# Altium project LimeSDR-QPCIe_1v2.PrjPcb (part 6 of 13)

## Sheet 16_FPGA_pwr_banks.SchDoc: FPGA power banks
size A3; Organization: Lime Microsystems; Address1: Surrey Tech Centre; Address2: Guildford GU2 7YG; Address3: Surrey; Address4: United Kingdom; Revision: v1.2; SheetNumber: 14; SheetTotal: 27
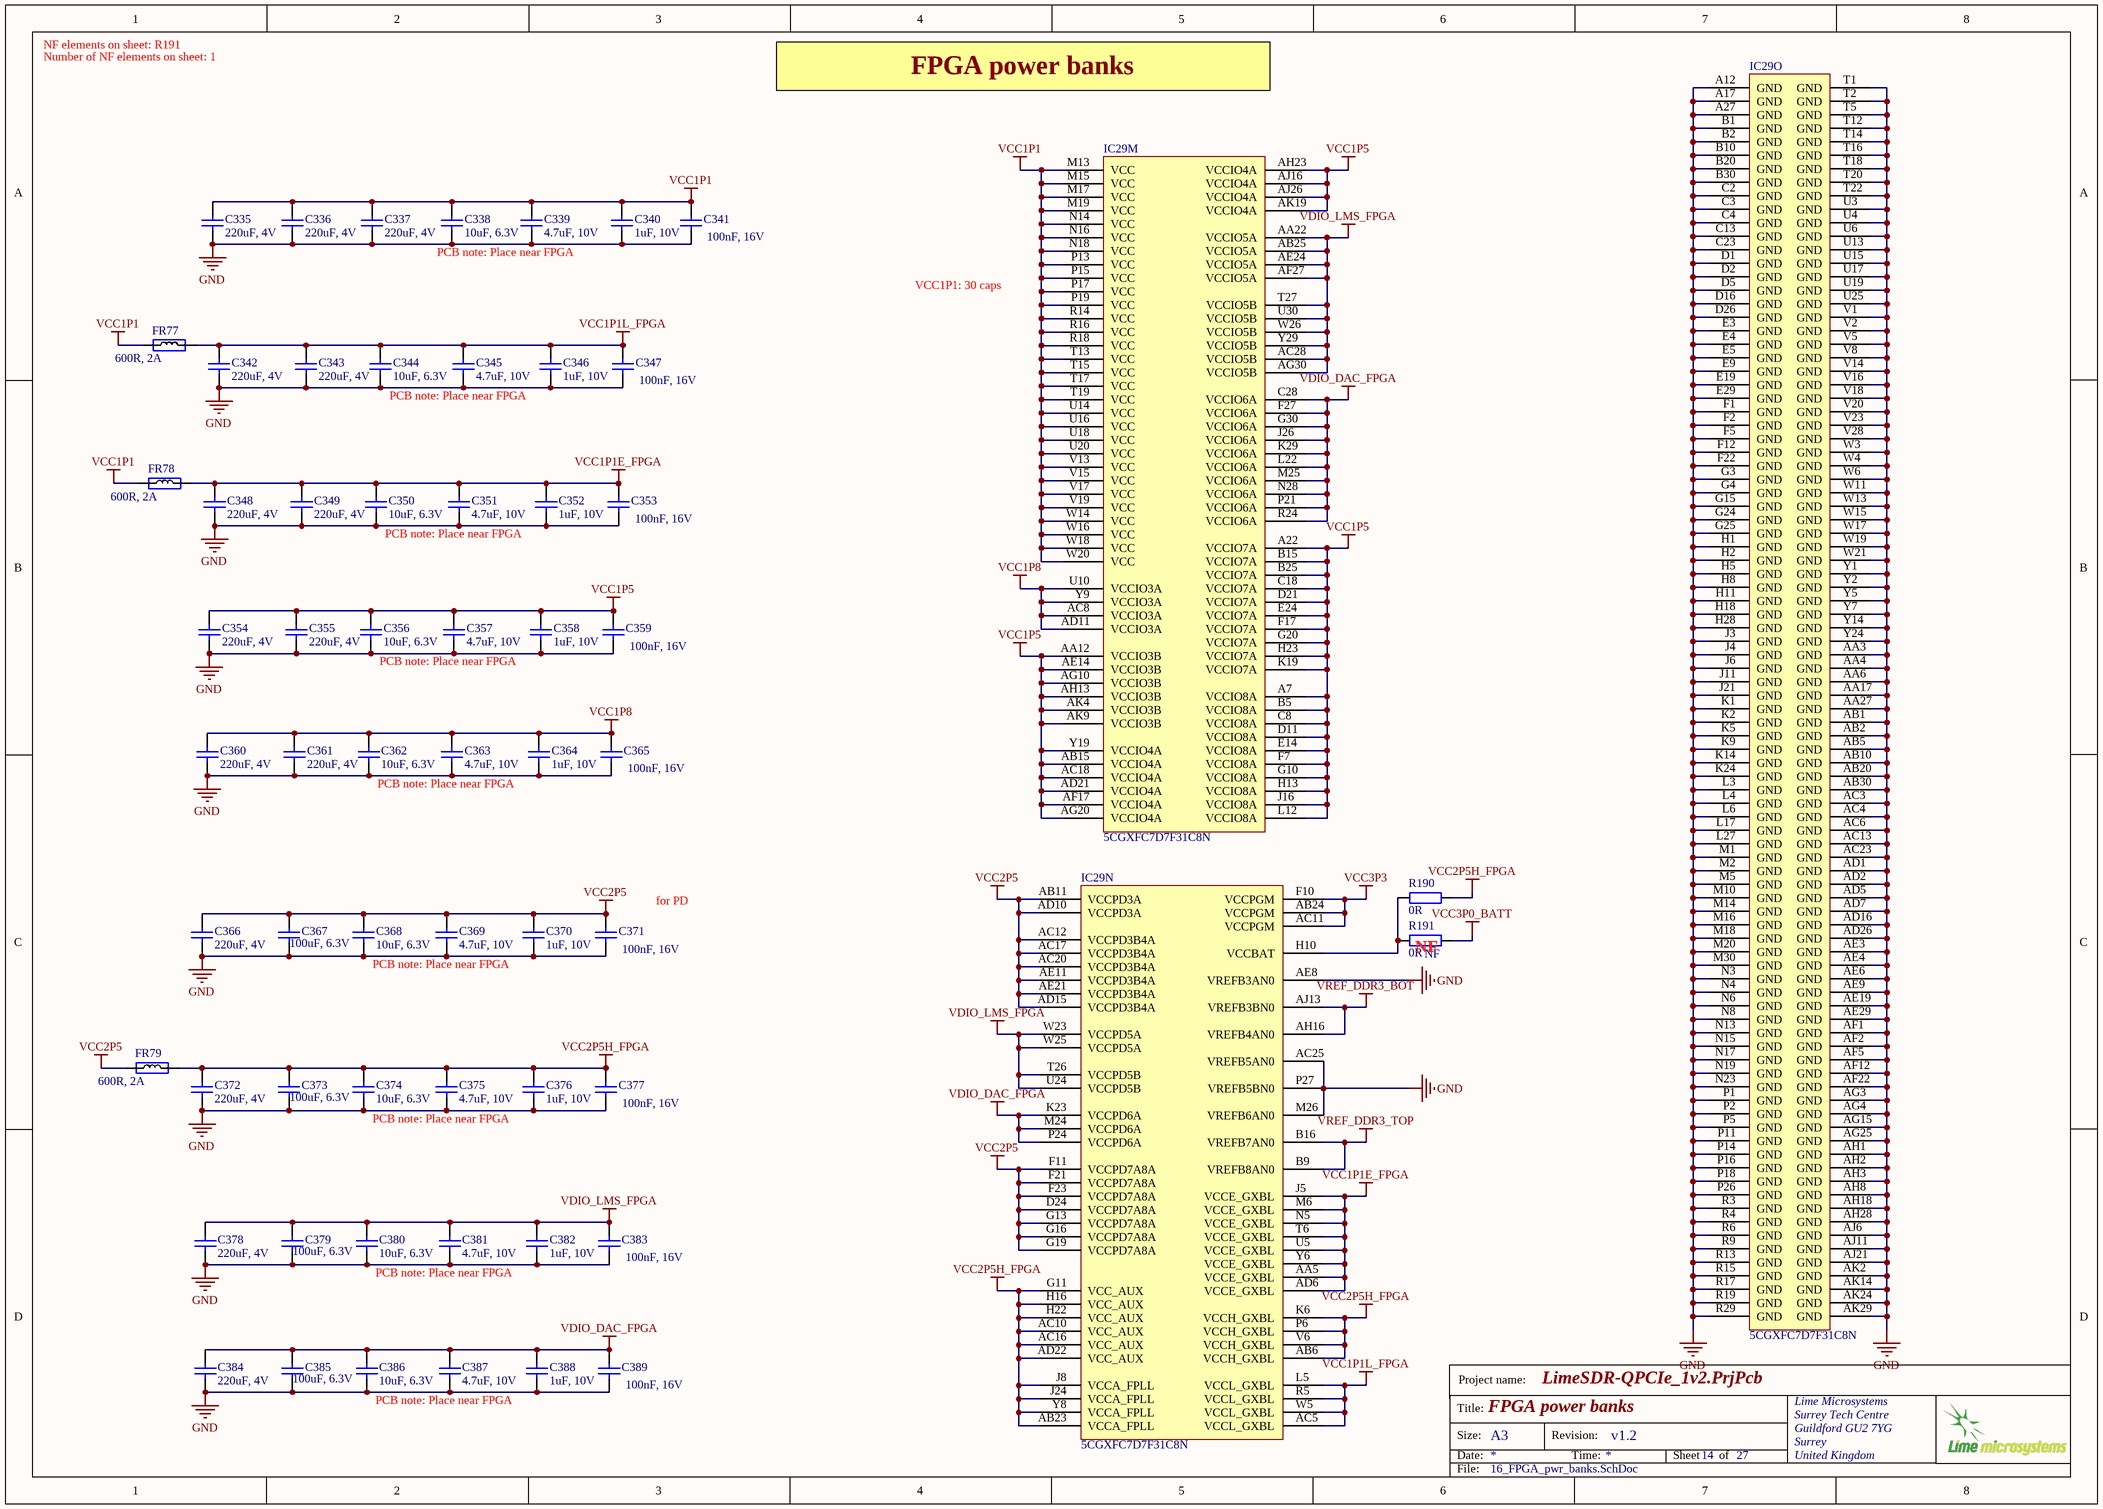
[diagram p15: 16_FPGA_pwr_banks.SchDoc]

### Parts
C335  220uF, 4V  [CAP1206]
C336  220uF, 4V  [CAP1206]
C337  220uF, 4V  [CAP1206]
C338  10uF, 6.3V  [CAP0603]
C339  4.7uF, 10V  [CAP0603]
C340  1uF, 10V  [CAP0402]
C341  100nF, 16V  [CAP0402]
C342  220uF, 4V  [CAP1206]
C343  220uF, 4V  [CAP1206]
C344  10uF, 6.3V  [CAP0603]
C345  4.7uF, 10V  [CAP0603]
C346  1uF, 10V  [CAP0402]
C347  100nF, 16V  [CAP0402]
C348  220uF, 4V  [CAP1206]
C349  220uF, 4V  [CAP1206]
C350  10uF, 6.3V  [CAP0603]
C351  4.7uF, 10V  [CAP0603]
C352  1uF, 10V  [CAP0402]
C353  100nF, 16V  [CAP0402]
C354  220uF, 4V  [CAP1206]
C355  220uF, 4V  [CAP1206]
C356  10uF, 6.3V  [CAP0603]
C357  4.7uF, 10V  [CAP0603]
C358  1uF, 10V  [CAP0402]
C359  100nF, 16V  [CAP0402]
C360  220uF, 4V  [CAP1206]
C361  220uF, 4V  [CAP1206]
C362  10uF, 6.3V  [CAP0603]
C363  4.7uF, 10V  [CAP0603]
C364  1uF, 10V  [CAP0402]
C365  100nF, 16V  [CAP0402]
C366  220uF, 4V  [CAP1206]
C367  100uF, 6.3V  [CAP1206]
C368  10uF, 6.3V  [CAP0603]
C369  4.7uF, 10V  [CAP0603]
C370  1uF, 10V  [CAP0402]
C371  100nF, 16V  [CAP0402]
C372  220uF, 4V  [CAP1206]
C373  100uF, 6.3V  [CAP1206]
C374  10uF, 6.3V  [CAP0603]
C375  4.7uF, 10V  [CAP0603]
C376  1uF, 10V  [CAP0402]
C377  100nF, 16V  [CAP0402]
C378  220uF, 4V  [CAP1206]
C379  100uF, 6.3V  [CAP1206]
C380  10uF, 6.3V  [CAP0603]
C381  4.7uF, 10V  [CAP0603]
C382  1uF, 10V  [CAP0402]
C383  100nF, 16V  [CAP0402]
C384  220uF, 4V  [CAP1206]
C385  100uF, 6.3V  [CAP1206]
C386  10uF, 6.3V  [CAP0603]
C387  4.7uF, 10V  [CAP0603]
C388  1uF, 10V  [CAP0402]
C389  100nF, 16V  [CAP0402]
FR77  600R, 2A  [RES0805]
FR78  600R, 2A  [RES0805]
FR79  600R, 2A  [RES0805]
IC29  5CGXFC7D7F31C8N  [ALTR-FBGA896_A-200]  (parts M,N,O of 16)
R190  0R  [RES0402]
R191  0R  Assembly Info: NF  [RES0402]

### Nets
GND: C335.1 C336.1 C337.1 C338.1 C339.1 C340.2 C341.2 C342.1 C343.1 C344.1 C345.1 C346.1 C347.2 C348.1 C349.1 C350.1 C351.1 C352.1 C353.2 C354.1 C355.1 C356.1 C357.1 C358.1 C359.2 C360.1 C361.1 C362.1 C363.1 C364.1 C365.2 C366.1 C367.1 C368.1 C369.1 C370.1 C371.2 C372.1 C373.1 C374.1 C375.1 C376.1 C377.2 C378.1 C379.1 C380.1 C381.1 C382.1 C383.2 C384.1 C385.1 C386.1 C387.1 C388.1 C389.2 IC29.A12(GND) IC29.A17(GND) IC29.A27(GND) IC29.AA3(GND) IC29.AA4(GND) IC29.AA6(GND) IC29.AA17(GND) IC29.AA27(GND) IC29.AB1(GND) IC29.AB2(GND) IC29.AB5(GND) IC29.AB10(GND) IC29.AB20(GND) IC29.AB30(GND) IC29.AC3(GND) IC29.AC4(GND) IC29.AC6(GND) IC29.AC13(GND) IC29.AC23(GND) IC29.AC25(VREFB5AN0) IC29.AD1(GND) IC29.AD2(GND) IC29.AD5(GND) IC29.AD7(GND) IC29.AD16(GND) IC29.AD26(GND) IC29.AE3(GND) IC29.AE4(GND) IC29.AE6(GND) IC29.AE8(VREFB3AN0) IC29.AE9(GND) IC29.AE19(GND) IC29.AE29(GND) IC29.AF1(GND) IC29.AF2(GND) IC29.AF5(GND) IC29.AF12(GND) IC29.AF22(GND) IC29.AG3(GND) IC29.AG4(GND) IC29.AG15(GND) IC29.AG25(GND) IC29.AH1(GND) IC29.AH2(GND) IC29.AH3(GND) IC29.AH8(GND) IC29.AH18(GND) IC29.AH28(GND) IC29.AJ6(GND) IC29.AJ11(GND) IC29.AJ21(GND) IC29.AK2(GND) IC29.AK14(GND) IC29.AK24(GND) IC29.AK29(GND) IC29.B1(GND) IC29.B2(GND) IC29.B10(GND) IC29.B20(GND) IC29.B30(GND) IC29.C2(GND) IC29.C3(GND) IC29.C4(GND) IC29.C13(GND) IC29.C23(GND) IC29.D1(GND) IC29.D2(GND) IC29.D5(GND) IC29.D16(GND) IC29.D26(GND) IC29.E3(GND) IC29.E4(GND) IC29.E5(GND) IC29.E9(GND) IC29.E19(GND) IC29.E29(GND) IC29.F1(GND) IC29.F2(GND) IC29.F5(GND) IC29.F12(GND) IC29.F22(GND) IC29.G3(GND) IC29.G4(GND) IC29.G15(GND) IC29.G24(GND) IC29.G25(GND) IC29.H1(GND) IC29.H2(GND) IC29.H5(GND) IC29.H8(GND) IC29.H11(GND) IC29.H18(GND) IC29.H28(GND) IC29.J3(GND) IC29.J4(GND) IC29.J6(GND) IC29.J11(GND) IC29.J21(GND) IC29.K1(GND) IC29.K2(GND) IC29.K5(GND) IC29.K9(GND) IC29.K14(GND) IC29.K24(GND) IC29.L3(GND) IC29.L4(GND) IC29.L6(GND) IC29.L17(GND) IC29.L27(GND) IC29.M1(GND) IC29.M2(GND) IC29.M5(GND) IC29.M10(GND) IC29.M14(GND) IC29.M16(GND) IC29.M18(GND) IC29.M20(GND) IC29.M26(VREFB6AN0) IC29.M30(GND) IC29.N3(GND) IC29.N4(GND) IC29.N6(GND) IC29.N8(GND) IC29.N13(GND) IC29.N15(GND) IC29.N17(GND) IC29.N19(GND) IC29.N23(GND) IC29.P1(GND) IC29.P2(GND) IC29.P5(GND) IC29.P11(GND) IC29.P14(GND) IC29.P16(GND) IC29.P18(GND) IC29.P26(GND) IC29.P27(VREFB5BN0) IC29.R3(GND) IC29.R4(GND) IC29.R6(GND) IC29.R9(GND) IC29.R13(GND) IC29.R15(GND) IC29.R17(GND) IC29.R19(GND) IC29.R29(GND) IC29.T1(GND) IC29.T2(GND) IC29.T5(GND) IC29.T12(GND) IC29.T14(GND) IC29.T16(GND) IC29.T18(GND) IC29.T20(GND) IC29.T22(GND) IC29.U3(GND) IC29.U4(GND) IC29.U6(GND) IC29.U13(GND) IC29.U15(GND) IC29.U17(GND) IC29.U19(GND) IC29.U25(GND) IC29.V1(GND) IC29.V2(GND) IC29.V5(GND) IC29.V8(GND) IC29.V14(GND) IC29.V16(GND) IC29.V18(GND) IC29.V20(GND) IC29.V23(GND) IC29.V28(GND) IC29.W3(GND) IC29.W4(GND) IC29.W6(GND) IC29.W11(GND) IC29.W13(GND) IC29.W15(GND) IC29.W17(GND) IC29.W19(GND) IC29.W21(GND) IC29.Y1(GND) IC29.Y2(GND) IC29.Y5(GND) IC29.Y7(GND) IC29.Y14(GND) IC29.Y24(GND)
VCC1P1: C335.2 C336.2 C337.2 C338.2 C339.2 C340.1 C341.1 FR77.1 FR78.1 IC29.M13(VCC) IC29.M15(VCC) IC29.M17(VCC) IC29.M19(VCC) IC29.N14(VCC) IC29.N16(VCC) IC29.N18(VCC) IC29.P13(VCC) IC29.P15(VCC) IC29.P17(VCC) IC29.P19(VCC) IC29.R14(VCC) IC29.R16(VCC) IC29.R18(VCC) IC29.T13(VCC) IC29.T15(VCC) IC29.T17(VCC) IC29.T19(VCC) IC29.U14(VCC) IC29.U16(VCC) IC29.U18(VCC) IC29.U20(VCC) IC29.V13(VCC) IC29.V15(VCC) IC29.V17(VCC) IC29.V19(VCC) IC29.W14(VCC) IC29.W16(VCC) IC29.W18(VCC) IC29.W20(VCC)
VCC1P1E_FPGA: C348.2 C349.2 C350.2 C351.2 C352.2 C353.1 FR78.2 IC29.AA5(VCCE_GXBL) IC29.AD6(VCCE_GXBL) IC29.J5(VCCE_GXBL) IC29.M6(VCCE_GXBL) IC29.N5(VCCE_GXBL) IC29.T6(VCCE_GXBL) IC29.U5(VCCE_GXBL) IC29.Y6(VCCE_GXBL)
VCC1P1L_FPGA: C342.2 C343.2 C344.2 C345.2 C346.2 C347.1 FR77.2 IC29.AC5(VCCL_GXBL) IC29.L5(VCCL_GXBL) IC29.R5(VCCL_GXBL) IC29.W5(VCCL_GXBL)
VCC1P5: C354.2 C355.2 C356.2 C357.2 C358.2 C359.1 IC29.A7(VCCIO8A) IC29.A22(VCCIO7A) IC29.AA12(VCCIO3B) IC29.AB15(VCCIO4A) IC29.AC18(VCCIO4A) IC29.AD21(VCCIO4A) IC29.AE14(VCCIO3B) IC29.AF17(VCCIO4A) IC29.AG10(VCCIO3B) IC29.AG20(VCCIO4A) IC29.AH13(VCCIO3B) IC29.AH23(VCCIO4A) IC29.AJ16(VCCIO4A) IC29.AJ26(VCCIO4A) IC29.AK4(VCCIO3B) IC29.AK9(VCCIO3B) IC29.AK19(VCCIO4A) IC29.B5(VCCIO8A) IC29.B15(VCCIO7A) IC29.B25(VCCIO7A) IC29.C8(VCCIO8A) IC29.C18(VCCIO7A) IC29.D11(VCCIO8A) IC29.D21(VCCIO7A) IC29.E14(VCCIO8A) IC29.E24(VCCIO7A) IC29.F7(VCCIO8A) IC29.F17(VCCIO7A) IC29.G10(VCCIO8A) IC29.G20(VCCIO7A) IC29.H13(VCCIO8A) IC29.H23(VCCIO7A) IC29.J16(VCCIO8A) IC29.K19(VCCIO7A) IC29.L12(VCCIO8A) IC29.Y19(VCCIO4A)
VCC1P8: C360.2 C361.2 C362.2 C363.2 C364.2 C365.1 IC29.AC8(VCCIO3A) IC29.AD11(VCCIO3A) IC29.U10(VCCIO3A) IC29.Y9(VCCIO3A)
VCC2P5: C366.2 C367.2 C368.2 C369.2 C370.2 C371.1 FR79.1 IC29.AB11(VCCPD3A) IC29.AC12(VCCPD3B4A) IC29.AC17(VCCPD3B4A) IC29.AC20(VCCPD3B4A) IC29.AD10(VCCPD3A) IC29.AD15(VCCPD3B4A) IC29.AE11(VCCPD3B4A) IC29.AE21(VCCPD3B4A) IC29.D24(VCCPD7A8A) IC29.F11(VCCPD7A8A) IC29.F21(VCCPD7A8A) IC29.F23(VCCPD7A8A) IC29.G13(VCCPD7A8A) IC29.G16(VCCPD7A8A) IC29.G19(VCCPD7A8A)
VCC2P5H_FPGA: C372.2 C373.2 C374.2 C375.2 C376.2 C377.1 FR79.2 IC29.AB6(VCCH_GXBL) IC29.AB23(VCCA_FPLL) IC29.AC10(VCC_AUX) IC29.AC16(VCC_AUX) IC29.AD22(VCC_AUX) IC29.G11(VCC_AUX) IC29.H16(VCC_AUX) IC29.H22(VCC_AUX) IC29.J8(VCCA_FPLL) IC29.J24(VCCA_FPLL) IC29.K6(VCCH_GXBL) IC29.P6(VCCH_GXBL) IC29.V6(VCCH_GXBL) IC29.Y8(VCCA_FPLL) R190.1
VCC3P0_BATT: R191.1
VCC3P3: IC29.AB24(VCCPGM) IC29.AC11(VCCPGM) IC29.F10(VCCPGM)
VDIO_DAC_FPGA: C384.2 C385.2 C386.2 C387.2 C388.2 C389.1 IC29.C28(VCCIO6A) IC29.F27(VCCIO6A) IC29.G30(VCCIO6A) IC29.J26(VCCIO6A) IC29.K23(VCCPD6A) IC29.K29(VCCIO6A) IC29.L22(VCCIO6A) IC29.M24(VCCPD6A) IC29.M25(VCCIO6A) IC29.N28(VCCIO6A) IC29.P21(VCCIO6A) IC29.P24(VCCPD6A) IC29.R24(VCCIO6A)
VDIO_LMS_FPGA: C378.2 C379.2 C380.2 C381.2 C382.2 C383.1 IC29.AA22(VCCIO5A) IC29.AB25(VCCIO5A) IC29.AC28(VCCIO5B) IC29.AE24(VCCIO5A) IC29.AF27(VCCIO5A) IC29.AG30(VCCIO5B) IC29.T26(VCCPD5B) IC29.T27(VCCIO5B) IC29.U24(VCCPD5B) IC29.U30(VCCIO5B) IC29.W23(VCCPD5A) IC29.W25(VCCPD5A) IC29.W26(VCCIO5B) IC29.Y29(VCCIO5B)
VREF_DDR3_BOT: IC29.AH16(VREFB4AN0) IC29.AJ13(VREFB3BN0)
VREF_DDR3_TOP: IC29.B9(VREFB8AN0) IC29.B16(VREFB7AN0)
NetIC29_H10: IC29.H10(VCCBAT) R190.2 R191.2

### Notes on the sheet
- NF elements on sheet: R191
- Number of NF elements on sheet: 1
- FPGA power banks
- PCB note: Place near FPGA
- VCC1P1: 30 caps
- (near C371) for PD
- (near R191) NF
- Project name:
- Title:
- Size:
- Date:
- A3
- Revision:
- Time:
- Sheet
- of
- File:

### Library data of the parts
C335-C337 C342 C343 C348 C349 C354 C355 C360 C361 C366 C372 C378 C384 = Cap_1206: Manufacturer Part Number: GRM31CR60G227ME11L; Manufacturer: Murata Electronics North America; Part Description: 220µF ±20% 4V Ceramic Capacitor X5R 1206 (3216 Metric); Capacitance: 220µF; Temperature Coefficient: X5R; Tolerance: ±20%; Package / Case: 1206 (3216 Metric); Supplier 1: Digi-Key; Packaging: Cut Tape (CT); Size / Dimension: 0.126" L x 0.063" W (3.20mm x 1.60mm); Operating Temperature: -55°C ~ 85°C; Voltage - Rated: 4V; Mounting Type: Surface Mount, MLCC; Ratings: -; Supplier Part Number 1: 490-9774-1-ND; Category: Capacitors; Lead Spacing: -; Lead Style: -; Applications: General Purpose; Features: -; Height - Seated (Max): -; Thickness (Max): 0.075" (1.90mm); RoHS: RoHS Compliant; Value: 220uF, 4V
C338 C344 C350 C356 C362 C368 C374 C380 C386 = Cap_0603: Manufacturer Part Number 1: CC0603MRX5R5BB106; Part Description: 10µF ±20% 6.3V Ceramic Capacitor X5R 0603 (1608 Metric); Manufacturer: Yageo; Capacitance: 10µF; Tolerance: ±20%; Supplier 1: Digi-Key; Supplier Part Number 1: 311-1448-2-ND; Package / Case: 0603 (1608 Metric); Category: Capacitors; Voltage - Rated: 6.3V; Value: 10uF, 6.3V
C339 C345 C351 C357 C363 C369 C375 C381 C387 = Cap_0603: Manufacturer Part Number 1: CGB3B1X5R1A475K055AC; Part Description: 4.7µF ±10% 10V Ceramic Capacitor X5R 0603 (1608 Metric); Manufacturer: TDK Corporation; Tolerance: 10 %; Temperature Coefficient / Code: +/- 15 %; Supplier 1: Mouser; Supplier Part Number 1: 810-CGB3B1X5R1A475KC; Capacitance: 4.7 uF; Operating Temperature Range: - 55 C to + 85 C; Voltage Rating DC: 10 V; Category: Multilayer Ceramic Capacitors MLCC - SMD/SMT; Case Code - in: 0603; Package / Case: 0603 (1608 metric); value: 4.7uF, 10V
C340 C346 C352 C358 C364 C370 C376 C382 C388 = Cap_0402: Manufacturer Part Number 1: GRM155R61A105KE15J; Manufacturer: TDK; Part Description: 1µF ±10% 10V Ceramic Capacitor X5R 0402 (1005 Metric); Voltage Rating: 10; Capacitance Tolerance: ± 10%; Product Range: TDK - C Series; Ceramic Capacitor Case: 0402 [1005 Metric]; Capacitance: 1; Dielectric Characteristic: X6; Value: 1uF, 10V; Supplier 1: Newark; Supplier Part Number 1: 490-6298-2-ND; MSL: -; RoHS: YES
C341 C347 C353 C359 C365 C371 C377 C383 C389 = Cap_0603: Manufacturer Part Number 1: GRM155R71C104KA88D; Part Description: 0.10µF ±10% 16V Ceramic Capacitor X7R 0402 (1005 Metric); Brand: Murata Electronics; Tolerance: 10 %; Type: General Purpose MLCC; Capacitance: 0.1 uF; Temperature Coefficient / Code: +/- 15 %; Case Height: 0.5 mm; Case Length: 1 mm; Dielectric: X7R; Supplier 1: Mouser; Supplier Part Number 1: 81-GRM155R71C104KA88; Case Code - in: 0402; Manufacturer: Murata Electronics; Category: Multilayer Ceramic Capacitors MLCC - SMD/SMT; Voltage Rating DC: 16 V; Value: 100nF, 16V; Manufacturer Part Number: GRM155R71C104KA88D; Case Code - mm: 1005; Case Width: 0.5 mm; Maximum Operating Temperature: + 125 C; Minimum Operating Temperature: - 55 C; Minimum Order Quantity: 1; Operating Temperature Range: - 55 C to + 125 C; Package / Case: 0402 (1005 metric); Packaging: Reel; Product: General Type MLCCs; Product Category: Low & Medium Capacitance SMD Ceramic Chip Capacitors; Reeling: True; RoHS - Mouser: Y; RoHS: RoHS Compliant; Series: GRM; Standard Pack Qty: 10000; Termination Style: SMD/SMT
C367 C373 C379 C385 = Cap_1206: Manufacturer: MURATA; Manufacturer Part Number 1: GRM31CR60J107ME39L.; Part Description: SMD Multilayer Ceramic Capacitor, 1206 [3216 Metric], 100 µF, 6.3 V, ± 20%, X5R, GRM Series; Capacitance Tolerance: ± 20%; Ceramic Capacitor Case: 1206 [3216 Metric]; Voltage Rating: 6.3; value: 100uF, 6.3V; Supplier Part Number 1: 1735535; Supplier 1: Farnell
FR77-FR79 = Ferrite: Manufacturer Part Number 1: MPZ2012S601A; Manufacturer: TDK; Part Description: FERRITE BEAD 600 OHM 0805 1LN; Filter Type: Differential Mode - Single; Impedance @ Frequency: 600 Ohm @ 100MHz; DC Resistance (DCR): 100 mOhm Max; DC Current Rating: 2; DC Resistance Max: 0.1; Ferrite Case Style: 0805 [2012 Metric]; Ferrite Mounting: SMD; Impedance @ 100MHz: 600; Impedance Tolerance: ± 25%; Supplier 1: Farnell; Supplier Part Number 1: 1669753RL; Mounting Type: Surface Mount; RoHS: RoHS Compliant; Height (Max): 0.041" (1.05mm); Packaging: Tape & Reel (TR); Category: Filters; Current Rating: 2A; Package / Case: 0805 (2012 Metric); Size / Dimension: 0.079" L x 0.049" W (2.00mm x 1.25mm); Value: 600R, 2A; Core Material: Ferrite; Supplier: Farnell
IC29 = 5CGXFC7D7F31C8N: Cyclone V GX Family FPGA, 1.07 to 1.13 V Supply, 480 I/O Pins, 7 PLLs, 896-Pin FBGA, Speed Grade 8, Commercial Grade, RoHS Compliant; Manufacturer: Altera; Part Description: IC FPGA 480 I/O 896FBGA; GPIO: 480; Logic Elements (LE) (K): 149.5; Speed Grade: 8; DatasheetVersion: Rev. 3.4; PackageVersion: Rev. 2.0, 12/2012; PackageReference: FBGA896_A-200; PackageDescription: 896-Pin FineLine Ball-Grid Array (FBGA), Body 31 x 31 mm, Pitch 1 mm; Supplier 1: Digi-Key; Supplier Part Number 1: 544-2772-ND; Supplier 2: Mouser; Supplier Part Number 2: 989-5CGXFC7D7F31C8N; Device Group: 5CGXFC7; RoHS: RoHS Compliant; Subcategory: Cyclone V GX; Voltage Supply: 1.07 to 1.13 V; NexusDeviceID: 5CGXFC7D7F31C8N; Mounting Technology: Surface Mount; Code_JEDEC: MS-034-AAN-1; PartNumber: 5CGXFC7D7F31C8N; ComponentLink1Description: Manufacturer URL; ComponentLink1URL: http://www.altera.com; ComponentLink2Description: Datasheet; ComponentLink2URL: http://www.altera.com/literature/hb/cyclone-v/cv_51002.pdf; ComponentLink3Description: Package Specification; ComponentLink3URL: http://www.altera.com/devicepackaging/04R00435-01.pdf; ComponentLink4Description: Device Handbook URL; ComponentLink4URL: http://www.altera.com/literature/hb/cyclone-v/cyclone5_handbook.pdf; ComponentLink5Description: Device Pin-Out URL; ComponentLink5URL: http://www.altera.com/literature/dp/cyclone-v/5CGXFC7.xls; ComponentLink6Description: Device Overview URL; ComponentLink6URL: http://www.altera.com/literature/hb/cyclone-v/cv_51001.pdf; ComponentLink7Description: Product URL; ComponentLink7URL: http://www.buyaltera.com/scripts/partsearch.dll?Detail&name=5CGXFC7D7F31C8N-ND
R190 R191 = Res_0402: as R183-R188 on sheet 15_FPGA_misc_banks; Value: 0R; Supplier 1: Digi-Key; Supplier Part Number 1: 311-0.0JRTR-ND; Category: Resistors; Temperature Coefficient: -; Features: Moisture Resistant; Supplier Device Package: 0402; Height: 0.016" (0.40mm); Package / Case: 0402 (1005 Metric); Operating Temperature: -55°C ~ 155°C; Size / Dimension: 0.039" L x 0.020" W (1.00mm x 0.50mm); Composition: Thick Film; Packaging: Tape & Reel (TR); Number of Terminations: 2; RoHS: RoHS Compliant

## Sheet 17_FPGA_decoupling.SchDoc: FPGA Decoupling
size A3; Organization: Lime Microsystems; Address1: Surrey Tech Centre; Address2: Guildford GU2 7YG; Address3: Surrey; Address4: United Kingdom; Revision: v1.2; SheetNumber: 15; SheetTotal: 27
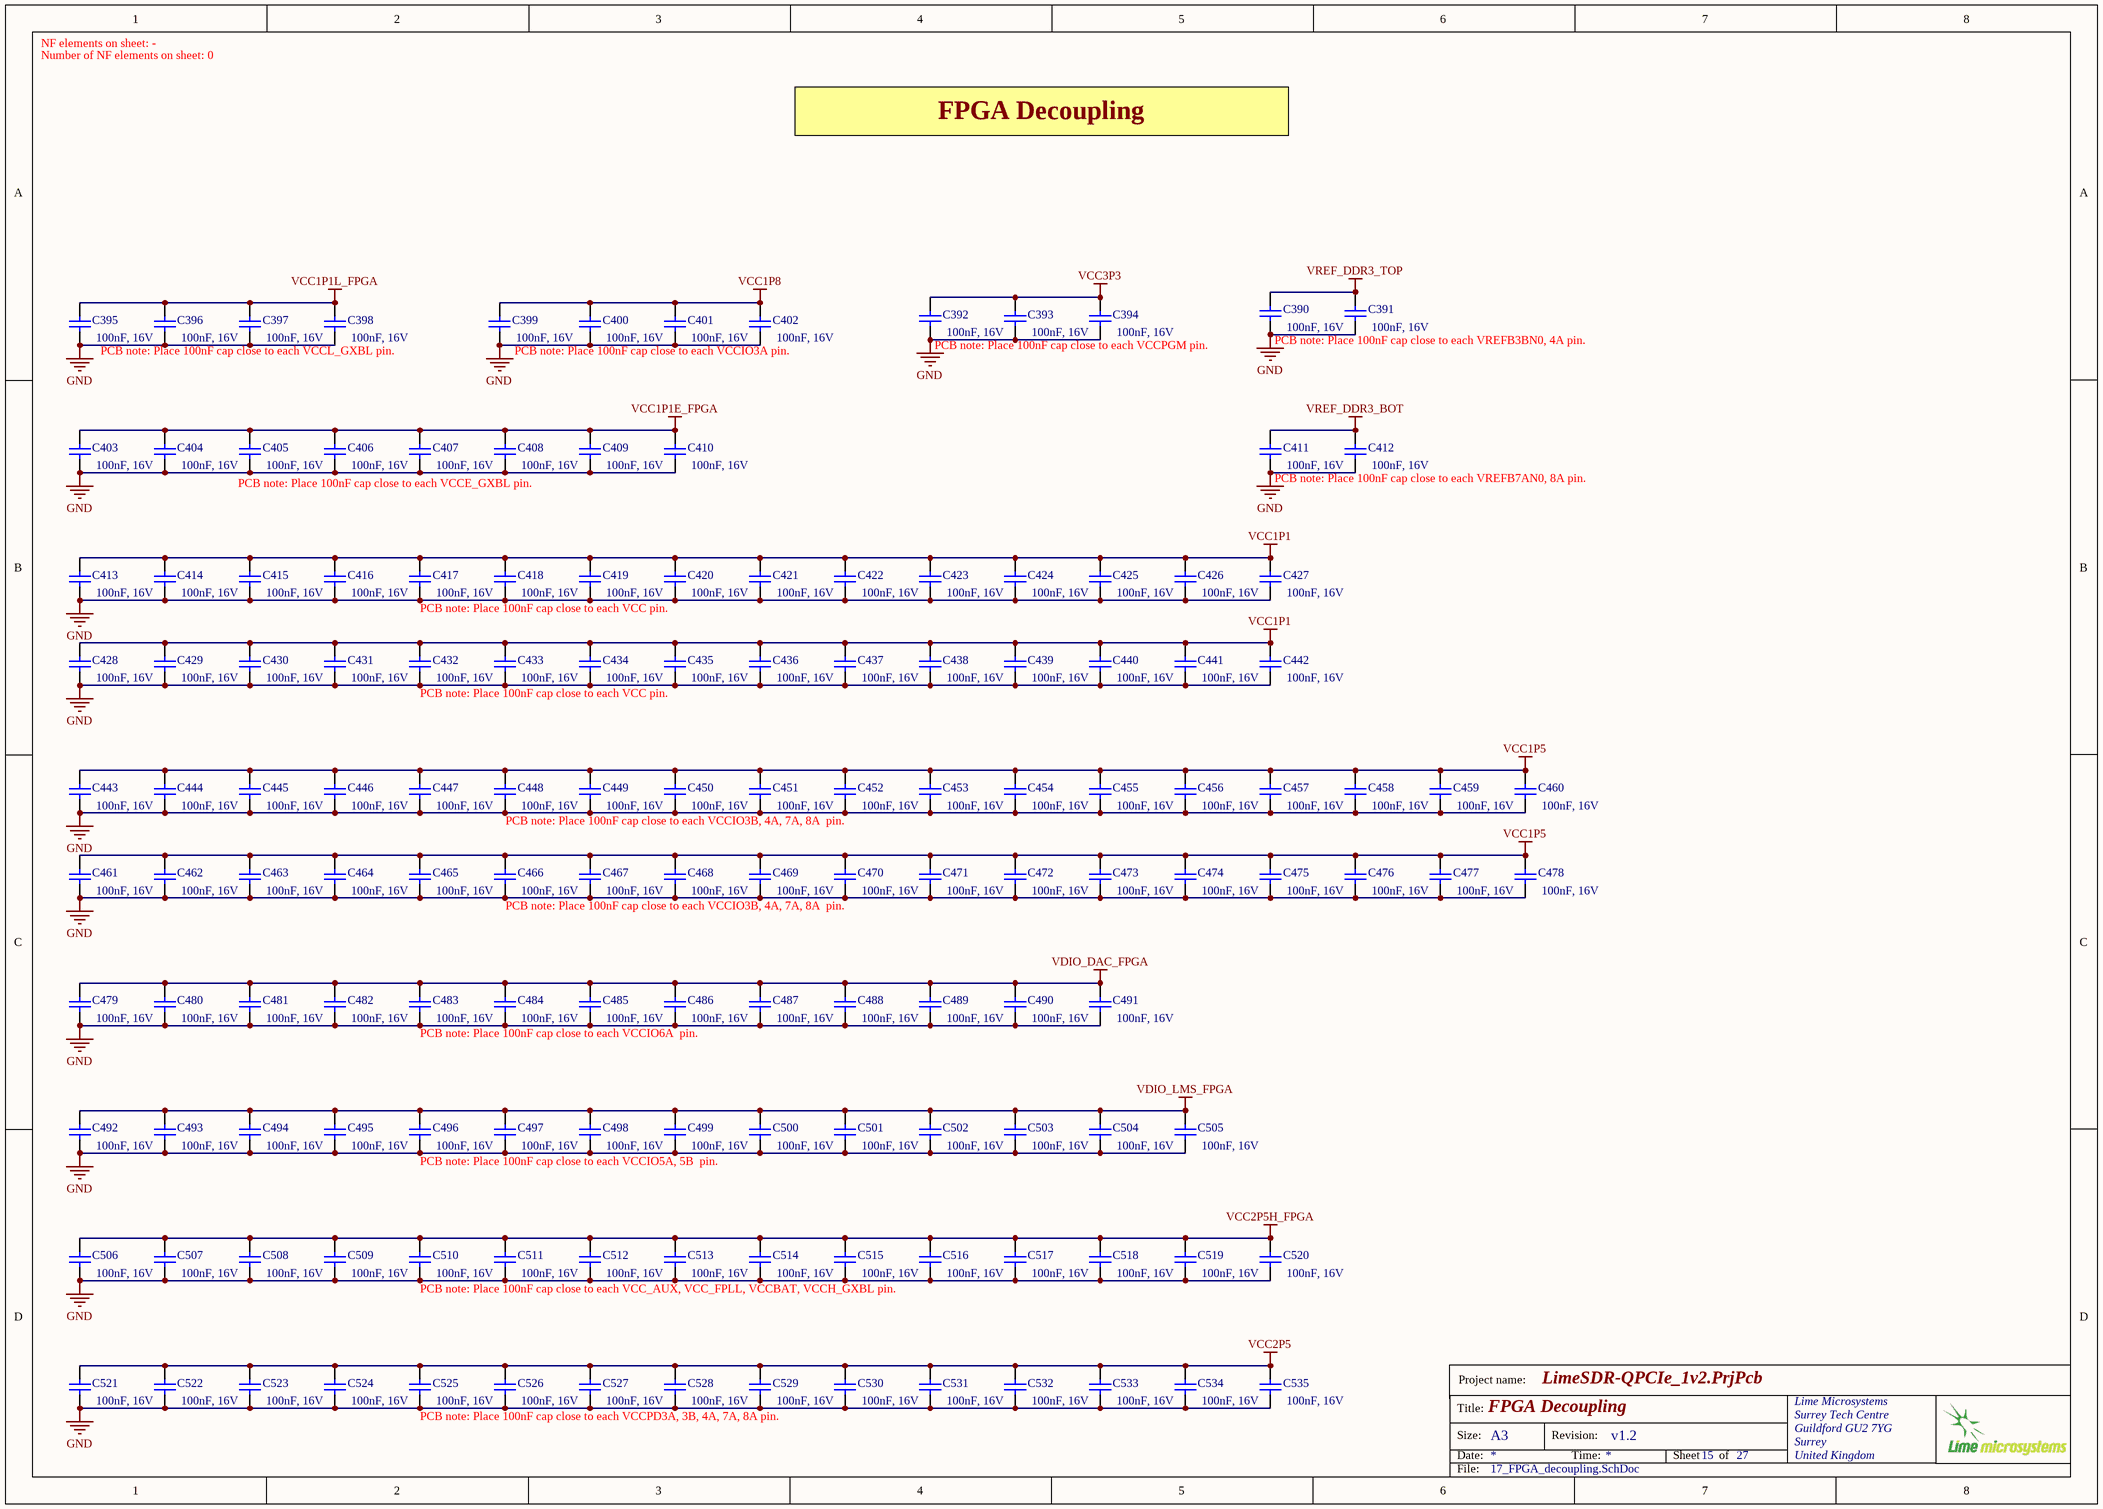
[diagram p16: 17_FPGA_decoupling.SchDoc]

### Parts
C390  100nF, 16V  [CAP0402]
C391  100nF, 16V  [CAP0402]
C392  100nF, 16V  [CAP0402]
C393  100nF, 16V  [CAP0402]
C394  100nF, 16V  [CAP0402]
C395  100nF, 16V  [CAP0402]
C396  100nF, 16V  [CAP0402]
C397  100nF, 16V  [CAP0402]
C398  100nF, 16V  [CAP0402]
C399  100nF, 16V  [CAP0402]
C400  100nF, 16V  [CAP0402]
C401  100nF, 16V  [CAP0402]
C402  100nF, 16V  [CAP0402]
C403  100nF, 16V  [CAP0402]
C404  100nF, 16V  [CAP0402]
C405  100nF, 16V  [CAP0402]
C406  100nF, 16V  [CAP0402]
C407  100nF, 16V  [CAP0402]
C408  100nF, 16V  [CAP0402]
C409  100nF, 16V  [CAP0402]
C410  100nF, 16V  [CAP0402]
C411  100nF, 16V  [CAP0402]
C412  100nF, 16V  [CAP0402]
C413  100nF, 16V  [CAP0402]
C414  100nF, 16V  [CAP0402]
C415  100nF, 16V  [CAP0402]
C416  100nF, 16V  [CAP0402]
C417  100nF, 16V  [CAP0402]
C418  100nF, 16V  [CAP0402]
C419  100nF, 16V  [CAP0402]
C420  100nF, 16V  [CAP0402]
C421  100nF, 16V  [CAP0402]
C422  100nF, 16V  [CAP0402]
C423  100nF, 16V  [CAP0402]
C424  100nF, 16V  [CAP0402]
C425  100nF, 16V  [CAP0402]
C426  100nF, 16V  [CAP0402]
C427  100nF, 16V  [CAP0402]
C428  100nF, 16V  [CAP0402]
C429  100nF, 16V  [CAP0402]
C430  100nF, 16V  [CAP0402]
C431  100nF, 16V  [CAP0402]
C432  100nF, 16V  [CAP0402]
C433  100nF, 16V  [CAP0402]
C434  100nF, 16V  [CAP0402]
C435  100nF, 16V  [CAP0402]
C436  100nF, 16V  [CAP0402]
C437  100nF, 16V  [CAP0402]
C438  100nF, 16V  [CAP0402]
C439  100nF, 16V  [CAP0402]
C440  100nF, 16V  [CAP0402]
C441  100nF, 16V  [CAP0402]
C442  100nF, 16V  [CAP0402]
C443  100nF, 16V  [CAP0402]
C444  100nF, 16V  [CAP0402]
C445  100nF, 16V  [CAP0402]
C446  100nF, 16V  [CAP0402]
C447  100nF, 16V  [CAP0402]
C448  100nF, 16V  [CAP0402]
C449  100nF, 16V  [CAP0402]
C450  100nF, 16V  [CAP0402]
C451  100nF, 16V  [CAP0402]
C452  100nF, 16V  [CAP0402]
C453  100nF, 16V  [CAP0402]
C454  100nF, 16V  [CAP0402]
C455  100nF, 16V  [CAP0402]
C456  100nF, 16V  [CAP0402]
C457  100nF, 16V  [CAP0402]
C458  100nF, 16V  [CAP0402]
C459  100nF, 16V  [CAP0402]
C460  100nF, 16V  [CAP0402]
C461  100nF, 16V  [CAP0402]
C462  100nF, 16V  [CAP0402]
C463  100nF, 16V  [CAP0402]
C464  100nF, 16V  [CAP0402]
C465  100nF, 16V  [CAP0402]
C466  100nF, 16V  [CAP0402]
C467  100nF, 16V  [CAP0402]
C468  100nF, 16V  [CAP0402]
C469  100nF, 16V  [CAP0402]
C470  100nF, 16V  [CAP0402]
C471  100nF, 16V  [CAP0402]
C472  100nF, 16V  [CAP0402]
C473  100nF, 16V  [CAP0402]
C474  100nF, 16V  [CAP0402]
C475  100nF, 16V  [CAP0402]
C476  100nF, 16V  [CAP0402]
C477  100nF, 16V  [CAP0402]
C478  100nF, 16V  [CAP0402]
C479  100nF, 16V  [CAP0402]
C480  100nF, 16V  [CAP0402]
C481  100nF, 16V  [CAP0402]
C482  100nF, 16V  [CAP0402]
C483  100nF, 16V  [CAP0402]
C484  100nF, 16V  [CAP0402]
C485  100nF, 16V  [CAP0402]
C486  100nF, 16V  [CAP0402]
C487  100nF, 16V  [CAP0402]
C488  100nF, 16V  [CAP0402]
C489  100nF, 16V  [CAP0402]
C490  100nF, 16V  [CAP0402]
C491  100nF, 16V  [CAP0402]
C492  100nF, 16V  [CAP0402]
C493  100nF, 16V  [CAP0402]
C494  100nF, 16V  [CAP0402]
C495  100nF, 16V  [CAP0402]
C496  100nF, 16V  [CAP0402]
C497  100nF, 16V  [CAP0402]
C498  100nF, 16V  [CAP0402]
C499  100nF, 16V  [CAP0402]
C500  100nF, 16V  [CAP0402]
C501  100nF, 16V  [CAP0402]
C502  100nF, 16V  [CAP0402]
C503  100nF, 16V  [CAP0402]
C504  100nF, 16V  [CAP0402]
C505  100nF, 16V  [CAP0402]
C506  100nF, 16V  [CAP0402]
C507  100nF, 16V  [CAP0402]
C508  100nF, 16V  [CAP0402]
C509  100nF, 16V  [CAP0402]
C510  100nF, 16V  [CAP0402]
C511  100nF, 16V  [CAP0402]
C512  100nF, 16V  [CAP0402]
C513  100nF, 16V  [CAP0402]
C514  100nF, 16V  [CAP0402]
C515  100nF, 16V  [CAP0402]
C516  100nF, 16V  [CAP0402]
C517  100nF, 16V  [CAP0402]
C518  100nF, 16V  [CAP0402]
C519  100nF, 16V  [CAP0402]
C520  100nF, 16V  [CAP0402]
C521  100nF, 16V  [CAP0402]
C522  100nF, 16V  [CAP0402]
C523  100nF, 16V  [CAP0402]
C524  100nF, 16V  [CAP0402]
C525  100nF, 16V  [CAP0402]
C526  100nF, 16V  [CAP0402]
C527  100nF, 16V  [CAP0402]
C528  100nF, 16V  [CAP0402]
C529  100nF, 16V  [CAP0402]
C530  100nF, 16V  [CAP0402]
C531  100nF, 16V  [CAP0402]
C532  100nF, 16V  [CAP0402]
C533  100nF, 16V  [CAP0402]
C534  100nF, 16V  [CAP0402]
C535  100nF, 16V  [CAP0402]

### Nets
GND: C390.2 C391.2 C392.2 C393.2 C394.2 C395.2 C396.2 C397.2 C398.2 C399.2 C400.2 C401.2 C402.2 C403.2 C404.2 C405.2 C406.2 C407.2 C408.2 C409.2 C410.2 C411.2 C412.2 C413.2 C414.2 C415.2 C416.2 C417.2 C418.2 C419.2 C420.2 C421.2 C422.2 C423.2 C424.2 C425.2 C426.2 C427.2 C428.2 C429.2 C430.2 C431.2 C432.2 C433.2 C434.2 C435.2 C436.2 C437.2 C438.2 C439.2 C440.2 C441.2 C442.2 C443.2 C444.2 C445.2 C446.2 C447.2 C448.2 C449.2 C450.2 C451.2 C452.2 C453.2 C454.2 C455.2 C456.2 C457.2 C458.2 C459.2 C460.2 C461.2 C462.2 C463.2 C464.2 C465.2 C466.2 C467.2 C468.2 C469.2 C470.2 C471.2 C472.2 C473.2 C474.2 C475.2 C476.2 C477.2 C478.2 C479.2 C480.2 C481.2 C482.2 C483.2 C484.2 C485.2 C486.2 C487.2 C488.2 C489.2 C490.2 C491.2 C492.2 C493.2 C494.2 C495.2 C496.2 C497.2 C498.2 C499.2 C500.2 C501.2 C502.2 C503.2 C504.2 C505.2 C506.2 C507.2 C508.2 C509.2 C510.2 C511.2 C512.2 C513.2 C514.2 C515.2 C516.2 C517.2 C518.2 C519.2 C520.2 C521.2 C522.2 C523.2 C524.2 C525.2 C526.2 C527.2 C528.2 C529.2 C530.2 C531.2 C532.2 C533.2 C534.2 C535.2
VCC1P1: C413.1 C414.1 C415.1 C416.1 C417.1 C418.1 C419.1 C420.1 C421.1 C422.1 C423.1 C424.1 C425.1 C426.1 C427.1 C428.1 C429.1 C430.1 C431.1 C432.1 C433.1 C434.1 C435.1 C436.1 C437.1 C438.1 C439.1 C440.1 C441.1 C442.1
VCC1P1E_FPGA: C403.1 C404.1 C405.1 C406.1 C407.1 C408.1 C409.1 C410.1
VCC1P1L_FPGA: C395.1 C396.1 C397.1 C398.1
VCC1P5: C443.1 C444.1 C445.1 C446.1 C447.1 C448.1 C449.1 C450.1 C451.1 C452.1 C453.1 C454.1 C455.1 C456.1 C457.1 C458.1 C459.1 C460.1 C461.1 C462.1 C463.1 C464.1 C465.1 C466.1 C467.1 C468.1 C469.1 C470.1 C471.1 C472.1 C473.1 C474.1 C475.1 C476.1 C477.1 C478.1
VCC1P8: C399.1 C400.1 C401.1 C402.1
VCC2P5: C521.1 C522.1 C523.1 C524.1 C525.1 C526.1 C527.1 C528.1 C529.1 C530.1 C531.1 C532.1 C533.1 C534.1 C535.1
VCC2P5H_FPGA: C506.1 C507.1 C508.1 C509.1 C510.1 C511.1 C512.1 C513.1 C514.1 C515.1 C516.1 C517.1 C518.1 C519.1 C520.1
VCC3P3: C392.1 C393.1 C394.1
VDIO_DAC_FPGA: C479.1 C480.1 C481.1 C482.1 C483.1 C484.1 C485.1 C486.1 C487.1 C488.1 C489.1 C490.1 C491.1
VDIO_LMS_FPGA: C492.1 C493.1 C494.1 C495.1 C496.1 C497.1 C498.1 C499.1 C500.1 C501.1 C502.1 C503.1 C504.1 C505.1
VREF_DDR3_BOT: C411.1 C412.1
VREF_DDR3_TOP: C390.1 C391.1

### Notes on the sheet
- NF elements on sheet: -
- Number of NF elements on sheet: 0
- FPGA Decoupling
- PCB note: Place 100nF cap close to each VCCL_GXBL pin.
- PCB note: Place 100nF cap close to each VCCIO3A pin.
- PCB note: Place 100nF cap close to each VCCPGM pin.
- PCB note: Place 100nF cap close to each VREFB3BN0, 4A pin.
- PCB note: Place 100nF cap close to each VCCE_GXBL pin.
- PCB note: Place 100nF cap close to each VREFB7AN0, 8A pin.
- PCB note: Place 100nF cap close to each VCC pin.
- PCB note: Place 100nF cap close to each VCCIO3B, 4A, 7A, 8A  pin.
- PCB note: Place 100nF cap close to each VCCIO6A  pin.
- PCB note: Place 100nF cap close to each VCCIO5A, 5B  pin.
- PCB note: Place 100nF cap close to each VCC_AUX, VCC_FPLL, VCCBAT, VCCH_GXBL pin.
- PCB note: Place 100nF cap close to each VCCPD3A, 3B, 4A, 7A, 8A pin.
- Project name:
- Title:
- Size:
- Date:
- A3
- Revision:
- Time:
- Sheet
- of
- File:

### Library data of the parts
C390-C535 = Cap_0603: as C341 on sheet 16_FPGA_pwr_banks; Supplier 1: Mouser; Supplier Part Number 1: 81-GRM155R71C104KA88; Case Code - in: 0402; Manufacturer: Murata Electronics; Category: Multilayer Ceramic Capacitors MLCC - SMD/SMT; Voltage Rating DC: 16 V; Value: 100nF, 16V; Manufacturer Part Number: GRM155R71C104KA88D; Case Code - mm: 1005; Case Width: 0.5 mm; Maximum Operating Temperature: + 125 C; Minimum Operating Temperature: - 55 C; Minimum Order Quantity: 1; Operating Temperature Range: - 55 C to + 125 C; Package / Case: 0402 (1005 metric); Packaging: Reel; Product: General Type MLCCs; Product Category: Low & Medium Capacitance SMD Ceramic Chip Capacitors; Reeling: True; RoHS - Mouser: Y; RoHS: RoHS Compliant; Series: GRM; Standard Pack Qty: 10000; Termination Style: SMD/SMT

## Sheet 18_DDR3_TOP.SchDoc: DDR3 top
size A3; Organization: Lime Microsystems; Address1: Surrey Tech Centre; Address2: Guildford GU2 7YG; Address3: Surrey; Address4: United Kingdom; Revision: v1.2; SheetNumber: 16; SheetTotal: 27
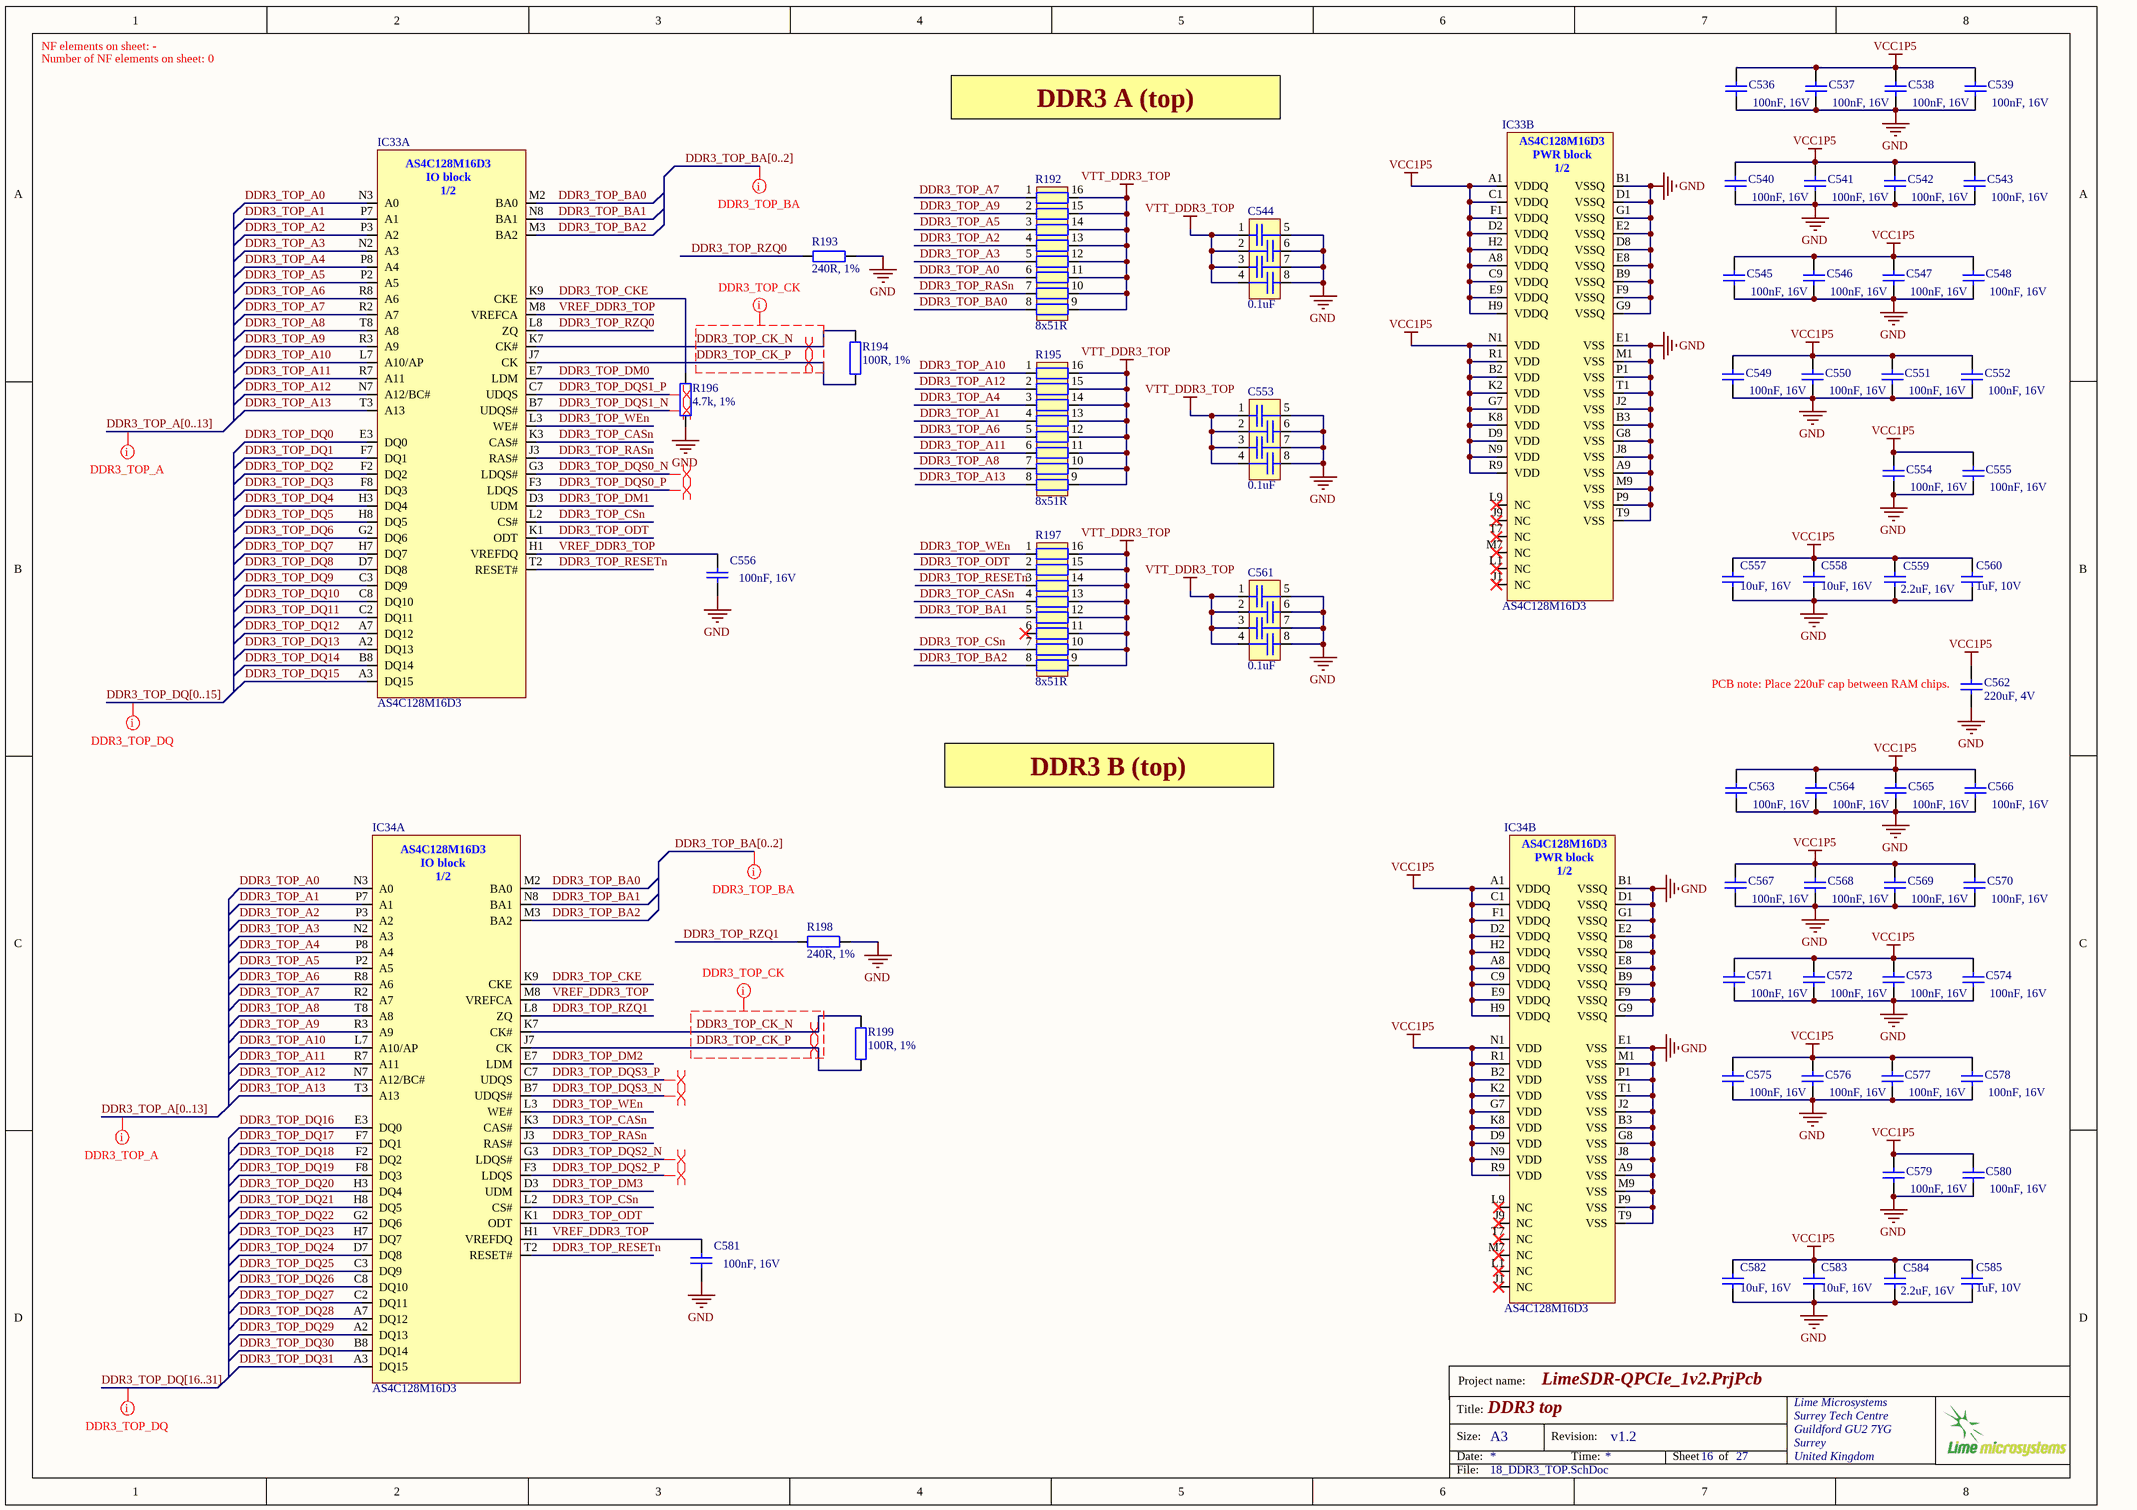
[diagram p17: 18_DDR3_TOP.SchDoc]

### Parts
C536  100nF, 16V  [CAP0402]
C537  100nF, 16V  [CAP0402]
C538  100nF, 16V  [CAP0402]
C539  100nF, 16V  [CAP0402]
C540  100nF, 16V  [CAP0402]
C541  100nF, 16V  [CAP0402]
C542  100nF, 16V  [CAP0402]
C543  100nF, 16V  [CAP0402]
C544  0.1uF  [CKCA43X7R1C104M100AA]
C545  100nF, 16V  [CAP0402]
C546  100nF, 16V  [CAP0402]
C547  100nF, 16V  [CAP0402]
C548  100nF, 16V  [CAP0402]
C549  100nF, 16V  [CAP0402]
C550  100nF, 16V  [CAP0402]
C551  100nF, 16V  [CAP0402]
C552  100nF, 16V  [CAP0402]
C553  0.1uF  [CKCA43X7R1C104M100AA]
C554  100nF, 16V  [CAP0402]
C555  100nF, 16V  [CAP0402]
C556  100nF, 16V  [CAP0402]
C557  10uF, 16V  [CAP0603]
C558  10uF, 16V  [CAP0603]
C559  2.2uF, 16V  [CAP0402]
C560  1uF, 10V  [CAP0402]
C561  0.1uF  [CKCA43X7R1C104M100AA]
C562  220uF, 4V  [CAP1206]
C563  100nF, 16V  [CAP0402]
C564  100nF, 16V  [CAP0402]
C565  100nF, 16V  [CAP0402]
C566  100nF, 16V  [CAP0402]
C567  100nF, 16V  [CAP0402]
C568  100nF, 16V  [CAP0402]
C569  100nF, 16V  [CAP0402]
C570  100nF, 16V  [CAP0402]
C571  100nF, 16V  [CAP0402]
C572  100nF, 16V  [CAP0402]
C573  100nF, 16V  [CAP0402]
C574  100nF, 16V  [CAP0402]
C575  100nF, 16V  [CAP0402]
C576  100nF, 16V  [CAP0402]
C577  100nF, 16V  [CAP0402]
C578  100nF, 16V  [CAP0402]
C579  100nF, 16V  [CAP0402]
C580  100nF, 16V  [CAP0402]
C581  100nF, 16V  [CAP0402]
C582  10uF, 16V  [CAP0603]
C583  10uF, 16V  [CAP0603]
C584  2.2uF, 16V  [CAP0402]
C585  1uF, 10V  [CAP0402]
IC33  AS4C128M16D3  [AS4C128M16D3]  (parts A,B of 2)
IC34  AS4C128M16D3  [AS4C128M16D3]  (parts A,B of 2)
R192  8x51R  [EXB2HV]
R193  240R, 1%  [RES0402]
R194  100R, 1%  [RES0402]
R195  8x51R  [EXB2HV]
R196  4.7k, 1%  [RES0402]
R197  8x51R  [EXB2HV]
R198  240R, 1%  [RES0402]
R199  100R, 1%  [RES0402]

### Nets
GND: C536.2 C537.2 C538.2 C539.2 C540.2 C541.2 C542.2 C543.2 C544.5 C544.6 C544.7 C544.8 C545.2 C546.2 C547.2 C548.2 C549.2 C550.2 C551.2 C552.2 C553.5 C553.6 C553.7 C553.8 C554.2 C555.2 C556.2 C557.1 C558.1 C559.2 C560.1 C561.5 C561.6 C561.7 C561.8 C562.1 C563.2 C564.2 C565.2 C566.2 C567.2 C568.2 C569.2 C570.2 C571.2 C572.2 C573.2 C574.2 C575.2 C576.2 C577.2 C578.2 C579.2 C580.2 C581.2 C582.1 C583.1 C584.2 C585.1 IC33.A9(VSS) IC33.B1(VSSQ) IC33.B3(VSS) IC33.B9(VSSQ) IC33.D1(VSSQ) IC33.D8(VSSQ) IC33.E1(VSS) IC33.E2(VSSQ) IC33.E8(VSSQ) IC33.F9(VSSQ) IC33.G1(VSSQ) IC33.G8(VSS) IC33.G9(VSSQ) IC33.J2(VSS) IC33.J8(VSS) IC33.M1(VSS) IC33.M9(VSS) IC33.P1(VSS) IC33.P9(VSS) IC33.T1(VSS) IC33.T9(VSS) IC34.A9(VSS) IC34.B1(VSSQ) IC34.B3(VSS) IC34.B9(VSSQ) IC34.D1(VSSQ) IC34.D8(VSSQ) IC34.E1(VSS) IC34.E2(VSSQ) IC34.E8(VSSQ) IC34.F9(VSSQ) IC34.G1(VSSQ) IC34.G8(VSS) IC34.G9(VSSQ) IC34.J2(VSS) IC34.J8(VSS) IC34.M1(VSS) IC34.M9(VSS) IC34.P1(VSS) IC34.P9(VSS) IC34.T1(VSS) IC34.T9(VSS) R193.2 R196.2 R198.2
VCC1P5: C536.1 C537.1 C538.1 C539.1 C540.1 C541.1 C542.1 C543.1 C545.1 C546.1 C547.1 C548.1 C549.1 C550.1 C551.1 C552.1 C554.1 C555.1 C557.2 C558.2 C559.1 C560.2 C562.2 C563.1 C564.1 C565.1 C566.1 C567.1 C568.1 C569.1 C570.1 C571.1 C572.1 C573.1 C574.1 C575.1 C576.1 C577.1 C578.1 C579.1 C580.1 C582.2 C583.2 C584.1 C585.2 IC33.A1(VDDQ) IC33.A8(VDDQ) IC33.B2(VDD) IC33.C1(VDDQ) IC33.C9(VDDQ) IC33.D2(VDDQ) IC33.D9(VDD) IC33.E9(VDDQ) IC33.F1(VDDQ) IC33.G7(VDD) IC33.H2(VDDQ) IC33.H9(VDDQ) IC33.K2(VDD) IC33.K8(VDD) IC33.N1(VDD) IC33.N9(VDD) IC33.R1(VDD) IC33.R9(VDD) IC34.A1(VDDQ) IC34.A8(VDDQ) IC34.B2(VDD) IC34.C1(VDDQ) IC34.C9(VDDQ) IC34.D2(VDDQ) IC34.D9(VDD) IC34.E9(VDDQ) IC34.F1(VDDQ) IC34.G7(VDD) IC34.H2(VDDQ) IC34.H9(VDDQ) IC34.K2(VDD) IC34.K8(VDD) IC34.N1(VDD) IC34.N9(VDD) IC34.R1(VDD) IC34.R9(VDD)
VREF_DDR3_TOP: C556.1 C581.1 IC33.H1(VREFDQ) IC33.M8(VREFCA) IC34.H1(VREFDQ) IC34.M8(VREFCA)
VTT_DDR3_TOP: C544.1 C544.2 C544.3 C544.4 C553.1 C553.2 C553.3 C553.4 C561.1 C561.2 C561.3 C561.4 R192.9 R192.10 R192.11 R192.12 R192.13 R192.14 R192.15 R192.16 R195.9 R195.10 R195.11 R195.12 R195.13 R195.14 R195.15 R195.16 R197.9 R197.10 R197.11 R197.12 R197.13 R197.14 R197.15 R197.16
DDR3_TOP_A0: IC33.N3(A0) IC34.N3(A0) R192.6
DDR3_TOP_A1: IC33.P7(A1) IC34.P7(A1) R195.4
DDR3_TOP_A2: IC33.P3(A2) IC34.P3(A2) R192.4
DDR3_TOP_A3: IC33.N2(A3) IC34.N2(A3) R192.5
DDR3_TOP_A4: IC33.P8(A4) IC34.P8(A4) R195.3
DDR3_TOP_A5: IC33.P2(A5) IC34.P2(A5) R192.3
DDR3_TOP_A6: IC33.R8(A6) IC34.R8(A6) R195.5
DDR3_TOP_A7: IC33.R2(A7) IC34.R2(A7) R192.1
DDR3_TOP_A8: IC33.T8(A8) IC34.T8(A8) R195.7
DDR3_TOP_A9: IC33.R3(A9) IC34.R3(A9) R192.2
DDR3_TOP_A10: IC33.L7(A10/AP) IC34.L7(A10/AP) R195.1
DDR3_TOP_A11: IC33.R7(A11) IC34.R7(A11) R195.6
DDR3_TOP_A12: IC33.N7(A12/BC#) IC34.N7(A12/BC#) R195.2
DDR3_TOP_A13: IC33.T3(A13) IC34.T3(A13) R195.8
DDR3_TOP_BA0: IC33.M2(BA0) IC34.M2(BA0) R192.8
DDR3_TOP_BA1: IC33.N8(BA1) IC34.N8(BA1) R197.5
DDR3_TOP_BA2: IC33.M3(BA2) IC34.M3(BA2) R197.8
DDR3_TOP_CASn: IC33.K3(CAS#) IC34.K3(CAS#) R197.4
DDR3_TOP_CK_N: IC33.K7(CK#) IC34.K7(CK#) R194.2 R199.2
DDR3_TOP_CK_P: IC33.J7(CK) IC34.J7(CK) R194.1 R199.1
DDR3_TOP_CKE: IC33.K9(CKE) IC34.K9(CKE) R196.1
DDR3_TOP_CSn: IC33.L2(CS#) IC34.L2(CS#) R197.7
DDR3_TOP_DM0: IC33.E7(LDM)
DDR3_TOP_DM1: IC33.D3(UDM)
DDR3_TOP_DM2: IC34.E7(LDM)
DDR3_TOP_DM3: IC34.D3(UDM)
DDR3_TOP_DQ0: IC33.E3(DQ0)
DDR3_TOP_DQ1: IC33.F7(DQ1)
DDR3_TOP_DQ2: IC33.F2(DQ2)
DDR3_TOP_DQ3: IC33.F8(DQ3)
DDR3_TOP_DQ4: IC33.H3(DQ4)
DDR3_TOP_DQ5: IC33.H8(DQ5)
DDR3_TOP_DQ6: IC33.G2(DQ6)
DDR3_TOP_DQ7: IC33.H7(DQ7)
DDR3_TOP_DQ8: IC33.D7(DQ8)
DDR3_TOP_DQ9: IC33.C3(DQ9)
DDR3_TOP_DQ10: IC33.C8(DQ10)
DDR3_TOP_DQ11: IC33.C2(DQ11)
DDR3_TOP_DQ12: IC33.A7(DQ12)
DDR3_TOP_DQ13: IC33.A2(DQ13)
DDR3_TOP_DQ14: IC33.B8(DQ14)
DDR3_TOP_DQ15: IC33.A3(DQ15)
DDR3_TOP_DQ16: IC34.E3(DQ0)
DDR3_TOP_DQ17: IC34.F7(DQ1)
DDR3_TOP_DQ18: IC34.F2(DQ2)
DDR3_TOP_DQ19: IC34.F8(DQ3)
DDR3_TOP_DQ20: IC34.H3(DQ4)
DDR3_TOP_DQ21: IC34.H8(DQ5)
DDR3_TOP_DQ22: IC34.G2(DQ6)
DDR3_TOP_DQ23: IC34.H7(DQ7)
DDR3_TOP_DQ24: IC34.D7(DQ8)
DDR3_TOP_DQ25: IC34.C3(DQ9)
DDR3_TOP_DQ26: IC34.C8(DQ10)
DDR3_TOP_DQ27: IC34.C2(DQ11)
DDR3_TOP_DQ28: IC34.A7(DQ12)
DDR3_TOP_DQ29: IC34.A2(DQ13)
DDR3_TOP_DQ30: IC34.B8(DQ14)
DDR3_TOP_DQ31: IC34.A3(DQ15)
DDR3_TOP_DQS0_N: IC33.G3(LDQS#)
DDR3_TOP_DQS0_P: IC33.F3(LDQS)
DDR3_TOP_DQS1_N: IC33.B7(UDQS#)
DDR3_TOP_DQS1_P: IC33.C7(UDQS)
DDR3_TOP_DQS2_N: IC34.G3(LDQS#)
DDR3_TOP_DQS2_P: IC34.F3(LDQS)
DDR3_TOP_DQS3_N: IC34.B7(UDQS#)
DDR3_TOP_DQS3_P: IC34.C7(UDQS)
DDR3_TOP_ODT: IC33.K1(ODT) IC34.K1(ODT) R197.2
DDR3_TOP_RASn: IC33.J3(RAS#) IC34.J3(RAS#) R192.7
DDR3_TOP_RESETn: IC33.T2(RESET#) IC34.T2(RESET#) R197.3
DDR3_TOP_RZQ0: IC33.L8(ZQ) R193.1
DDR3_TOP_RZQ1: IC34.L8(ZQ) R198.1
DDR3_TOP_WEn: IC33.L3(WE#) IC34.L3(WE#) R197.1

Not connected (* = marked no-connect by the designer): IC33 J1(NC)* J9(NC)* L1(NC)* L9(NC)* M7(NC)* T7(NC)*; IC34 J1(NC)* J9(NC)* L1(NC)* L9(NC)* M7(NC)* T7(NC)*; R197 6*

### Buses and harness runs
bus DDR3_TOP_A[0..13]
bus DDR3_TOP_BA[0..2]
bus DDR3_TOP_DQ[0..15]
bus DDR3_TOP_DQ[16..31]

### Layout directives
net class DDR3_TOP_DQ: (no net found under the mark)
net class DDR3_TOP_BA: (no net found under the mark)
net class DDR3_TOP_A: (no net found under the mark)
differential pair: DDR3_TOP_CK_N, DDR3_TOP_CK_P, DDR3_TOP_DQS0_N, DDR3_TOP_DQS0_P, DDR3_TOP_DQS1_N, DDR3_TOP_DQS1_P, DDR3_TOP_DQS2_N, DDR3_TOP_DQS2_P, DDR3_TOP_DQS3_N, DDR3_TOP_DQS3_P
net class DDR3_TOP_CK: (no net found under the mark), DDR3_TOP_CK_N, DDR3_TOP_CK_P

### Notes on the sheet
- NF elements on sheet: -
- Number of NF elements on sheet: 0
- DDR3 A (top)
- (near C562) PCB note: Place 220uF cap between RAM chips.
- DDR3 B (top)
- Project name:
- Title:
- Size:
- Date:
- A3
- Revision:
- Time:
- Sheet
- of
- File:
- (in symbol AS4C128M16D3, part A) AS4C128M16D3 / IO block / 1/2
- (in symbol AS4C128M16D3, part B) AS4C128M16D3 / PWR block / 1/2

### Library data of the parts
C536-C543 C545-C552 C554-C556 C563-C581 = Cap_0603: Part Description: 0.10µF ±10% 16V Ceramic Capacitor X7R 0402 (1005 Metric); Manufacturer Part Number 1: GRM155R71C104KA88D; Brand: Murata Electronics; Tolerance: 10 %; Type: General Purpose MLCC; Capacitance: 0.1 uF; Temperature Coefficient / Code: +/- 15 %; Case Height: 0.5 mm; Case Length: 1 mm; Dielectric: X7R; Supplier 1: Mouser; Supplier Part Number 1: 81-GRM155R71C104KA88; Case Code - in: 0402; Manufacturer: Murata Electronics; Category: Multilayer Ceramic Capacitors MLCC - SMD/SMT; Voltage Rating DC: 16 V; Value: 100nF, 16V; Case Code - mm: 1005; Case Width: 0.5 mm; Manufacturer Part Number: GRM155R71C104KA88D; Maximum Operating Temperature: + 125 C; Minimum Operating Temperature: - 55 C; Minimum Order Quantity: 1; Operating Temperature Range: - 55 C to + 125 C; Package / Case: 0402 (1005 metric); Packaging: Reel; Product: General Type MLCCs; Product Category: Low & Medium Capacitance SMD Ceramic Chip Capacitors; Reeling: True; RoHS - Mouser: Y; RoHS: RoHS Compliant; Series: GRM; Standard Pack Qty: 10000; Termination Style: SMD/SMT
C544 C553 C561 = 4X_cap_array_1206: Manufacturer: TDK; Part Description: 0.10µF ±20% Isolated Capacitor 4 Array 16V X7R 1206 (3216 Metric); Case Height: 1 mm; Case Length: 3.2 mm; Case Width: 1.6 mm; Voltage Rating: 16 V; Number of Elements: 4; Tolerance: 20 %; Temperature Coefficient / Code: X7R; Value: 0.1uF; Supplier 1: Mouser; Supplier Part Number 1: 810-CKCA43X7R1C104M; RoHS: RoHS Compliant; Termination Style: SMD/SMT; Brand: TDK; Category: Capacitor Arrays & Networks; Product: Ceramic Capacitor Arrays; Series: CKC; Packaging: Reel; Operating Temperature Range: - 55 C to + 125 C; Manufacturer Part Number 1: CKCA43X7R1C104M100AA; Capacitance: 0.1 uF; Product Category: Capacitor Arrays; Standard Pack Qty: 2000; RoHS - Mouser: Y; Minimum Order Quantity: 1; Reeling: True
C557 C558 C582 C583 = Cap_0603: Manufacturer Part Number 1: GRM188R61C106MA73D; Manufacturer: Yageo; Part Description: 10µF ±20% 16V Ceramic Capacitor X5R 0603 (1608 Metric); Capacitance: 10µF; Tolerance: ±20%; Temperature Coefficient: X5R; Supplier 1: Digi-Key; Supplier Part Number 1: 490-7201-2-ND; Package / Case: 0603 (1608 Metric); Category: Capacitors; Voltage - Rated: 16V; Value: 10uF, 16V; Applications: General Purpose; Features: -; Height - Seated (Max): -; Lead Spacing: -; Lead Style: -; Mounting Type: Surface Mount, MLCC; Operating Temperature: -55°C ~ 85°C; Packaging: Tape & Reel (TR); Ratings: -; RoHS: RoHS Compliant; Size / Dimension: 0.063" L x 0.031" W (1.60mm x 0.80mm); Thickness (Max): 0.039" (1.00mm)
C559 C584 = Cap_0603: CAP CER 2.2UF 16V 10% X5R 0402; Manufacturer Part Number 1: C1005X5R1C225K050BC; Part Description: 2.2µF ±10% 16V Ceramic Capacitor X5R 0402 (1005 Metric); Manufacturer: TDK Corporation; Capacitance: 2.2µF; Capacitor Case Style: 0402 [1005 Metric]; Value: 2.2uF, 16V; Supplier 1: Digi-Key; Supplier Part Number 1: 445-9085-6-ND; Tolerance: ±10%; Operating Temperature: -55°C ~ 85°C; Voltage - Rated: 16V; Category: Capacitors; Package / Case: 0402 (1005 Metric); Operating Temperature Range: -55°C to +85; Applications: General Purpose; Features: -; Height - Seated (Max): -; Lead Spacing: -; Lead Style: -; Mounting Type: Surface Mount, MLCC; Packaging: Tape & Reel (TR); Ratings: -; RoHS: RoHS Compliant; Size / Dimension: 0.039" L x 0.020" W (1.00mm x 0.50mm); Temperature Coefficient: X5R; Thickness (Max): 0.022" (0.55mm)
C560 C585 = Cap_0603: Manufacturer: TDK; Manufacturer Part Number 1: GRM155R61A105KE15J; Part Description: 1µF ±10% 10V Ceramic Capacitor X5R 0402 (1005 Metric); Capacitance: 1; Capacitance Tolerance: ± 10%; Ceramic Capacitor Case: 0402 [1005 Metric]; Dielectric Characteristic: X6; Product Range: TDK - C Series; Voltage Rating: 10; Supplier 1: Newark; Supplier Part Number 1: 490-6298-2-ND; Value: 1uF, 10V; MSL: -; RoHS: YES
C562 = Cap_1206: as C335 on sheet 16_FPGA_pwr_banks; Package / Case: 1206 (3216 Metric); Supplier 1: Digi-Key; Packaging: Cut Tape (CT); Size / Dimension: 0.126" L x 0.063" W (3.20mm x 1.60mm); Operating Temperature: -55°C ~ 85°C; Voltage - Rated: 4V; Mounting Type: Surface Mount, MLCC; Ratings: -; Supplier Part Number 1: 490-9774-1-ND; Category: Capacitors; Lead Spacing: -; Lead Style: -; Applications: General Purpose; Features: -; Height - Seated (Max): -; Thickness (Max): 0.075" (1.90mm); RoHS: RoHS Compliant; Value: 220uF, 4V; Manufacturer Part Number 1: GRM31CR60G227ME11L
IC33 IC34 = AS4C128M16D3: Manufacturer: Alliance Memory, Inc.; Manufacturer Part Number 1: AS4C128M16D3-12BCN; Part Description: IC SDRAM DDR3 128M X 16 96-FBGA; Memory Size: 2G (128M x 16); Interface: Parallel; Voltage - Supply: 1.425 V ~ 1.575 V; Format - Memory: RAM; Supplier 1: Digi-Key; Supplier Part Number 1: 1450-1083-ND; Supplier Device Package: 96-FBGA (13x9); Package / Case: 96-TFBGA; Supplier: Digi-Key; Category: Integrated Circuits (ICs)
R192 R195 R197 = 8X_resistor_array_0402: Manufacturer: PANASONIC ELECTRONIC COMPONENTS; Manufacturer Part Number 1: EXB2HV510JV; Part Description: RES ARRAY 8 RES 51 OHM 1506; Supplier 1: Farnell; Supplier Part Number 1: 2060069RL; Manufacturer: Panasonic Electronic Components
R193 R198 = Res_0402: Part Description: RES SMD 240 OHM 1% 1/16W 0402; Manufacturer Part Number 1: CRCW0402240RFKED; Manufacturer: Vishay Dale; Power (Watts): 0.063W, 1/16W; Temperature Coefficient: ±100ppm/°C; Resistance (Ohms): 240; Supplier 1: Digi-Key; Supplier Part Number 1: 541-240LDKR-ND; Tolerance: ±1%; Supplier Device Package: 0402 (1005 Metric); Category: Resistors; Value: 240R, 1%
R194 R199 = Res_0402: Manufacturer Part Number 1: RMCF0402FT100R; Part Description: RES SMD 100 OHM 1% 1/16W 0402; Manufacturer: Stackpole Electronics Inc.; Temperature Coefficient: ±100ppm/°C; Supplier 1: Digi-Key; Supplier Part Number 1: RMCF0402FT100RDKR-ND; Package / Case: 0402 (1005 Metric); Composition: Thick Film; Category: Resistors; Tolerance: ±1%; Value: 100R, 1%
R196 = Res_0402: Manufacturer: Yageo; Part Description: RES SMD 4.7K OHM 1% 1/16W 0402; Manufacturer Part Number1: RC0402FR-074K7L; Temperature Coefficient: ±100ppm/°C; Power (Watts): 0.063W, 1/16W; Number of Terminations: 2; Category: Resistors; Supplier 1: Digi-Key; Height: 0.016" (0.40mm); Features: Moisture Resistant; Size / Dimension: 0.039" L x 0.020" W (1.00mm x 0.50mm); Supplier Device Package: 0402; RoHS: RoHS Compliant; Composition: Thick Film; Package / Case: 0402 (1005 Metric); Resistance (Ohms): 4.7k; Operating Temperature: -55°C ~ 155°C; Tolerance: ±1%; Supplier Part Number 1: 311-4.7KLRCT-ND; Packaging: Cut Tape (CT); Value: 4.7k, 1%

## Sheet 19_DDR3_BOT.SchDoc: DDR3 bot
size A3; Organization: Lime Microsystems; Address1: Surrey Tech Centre; Address2: Guildford GU2 7YG; Address3: Surrey; Address4: United Kingdom; Revision: v1.2; SheetNumber: 17; SheetTotal: 27
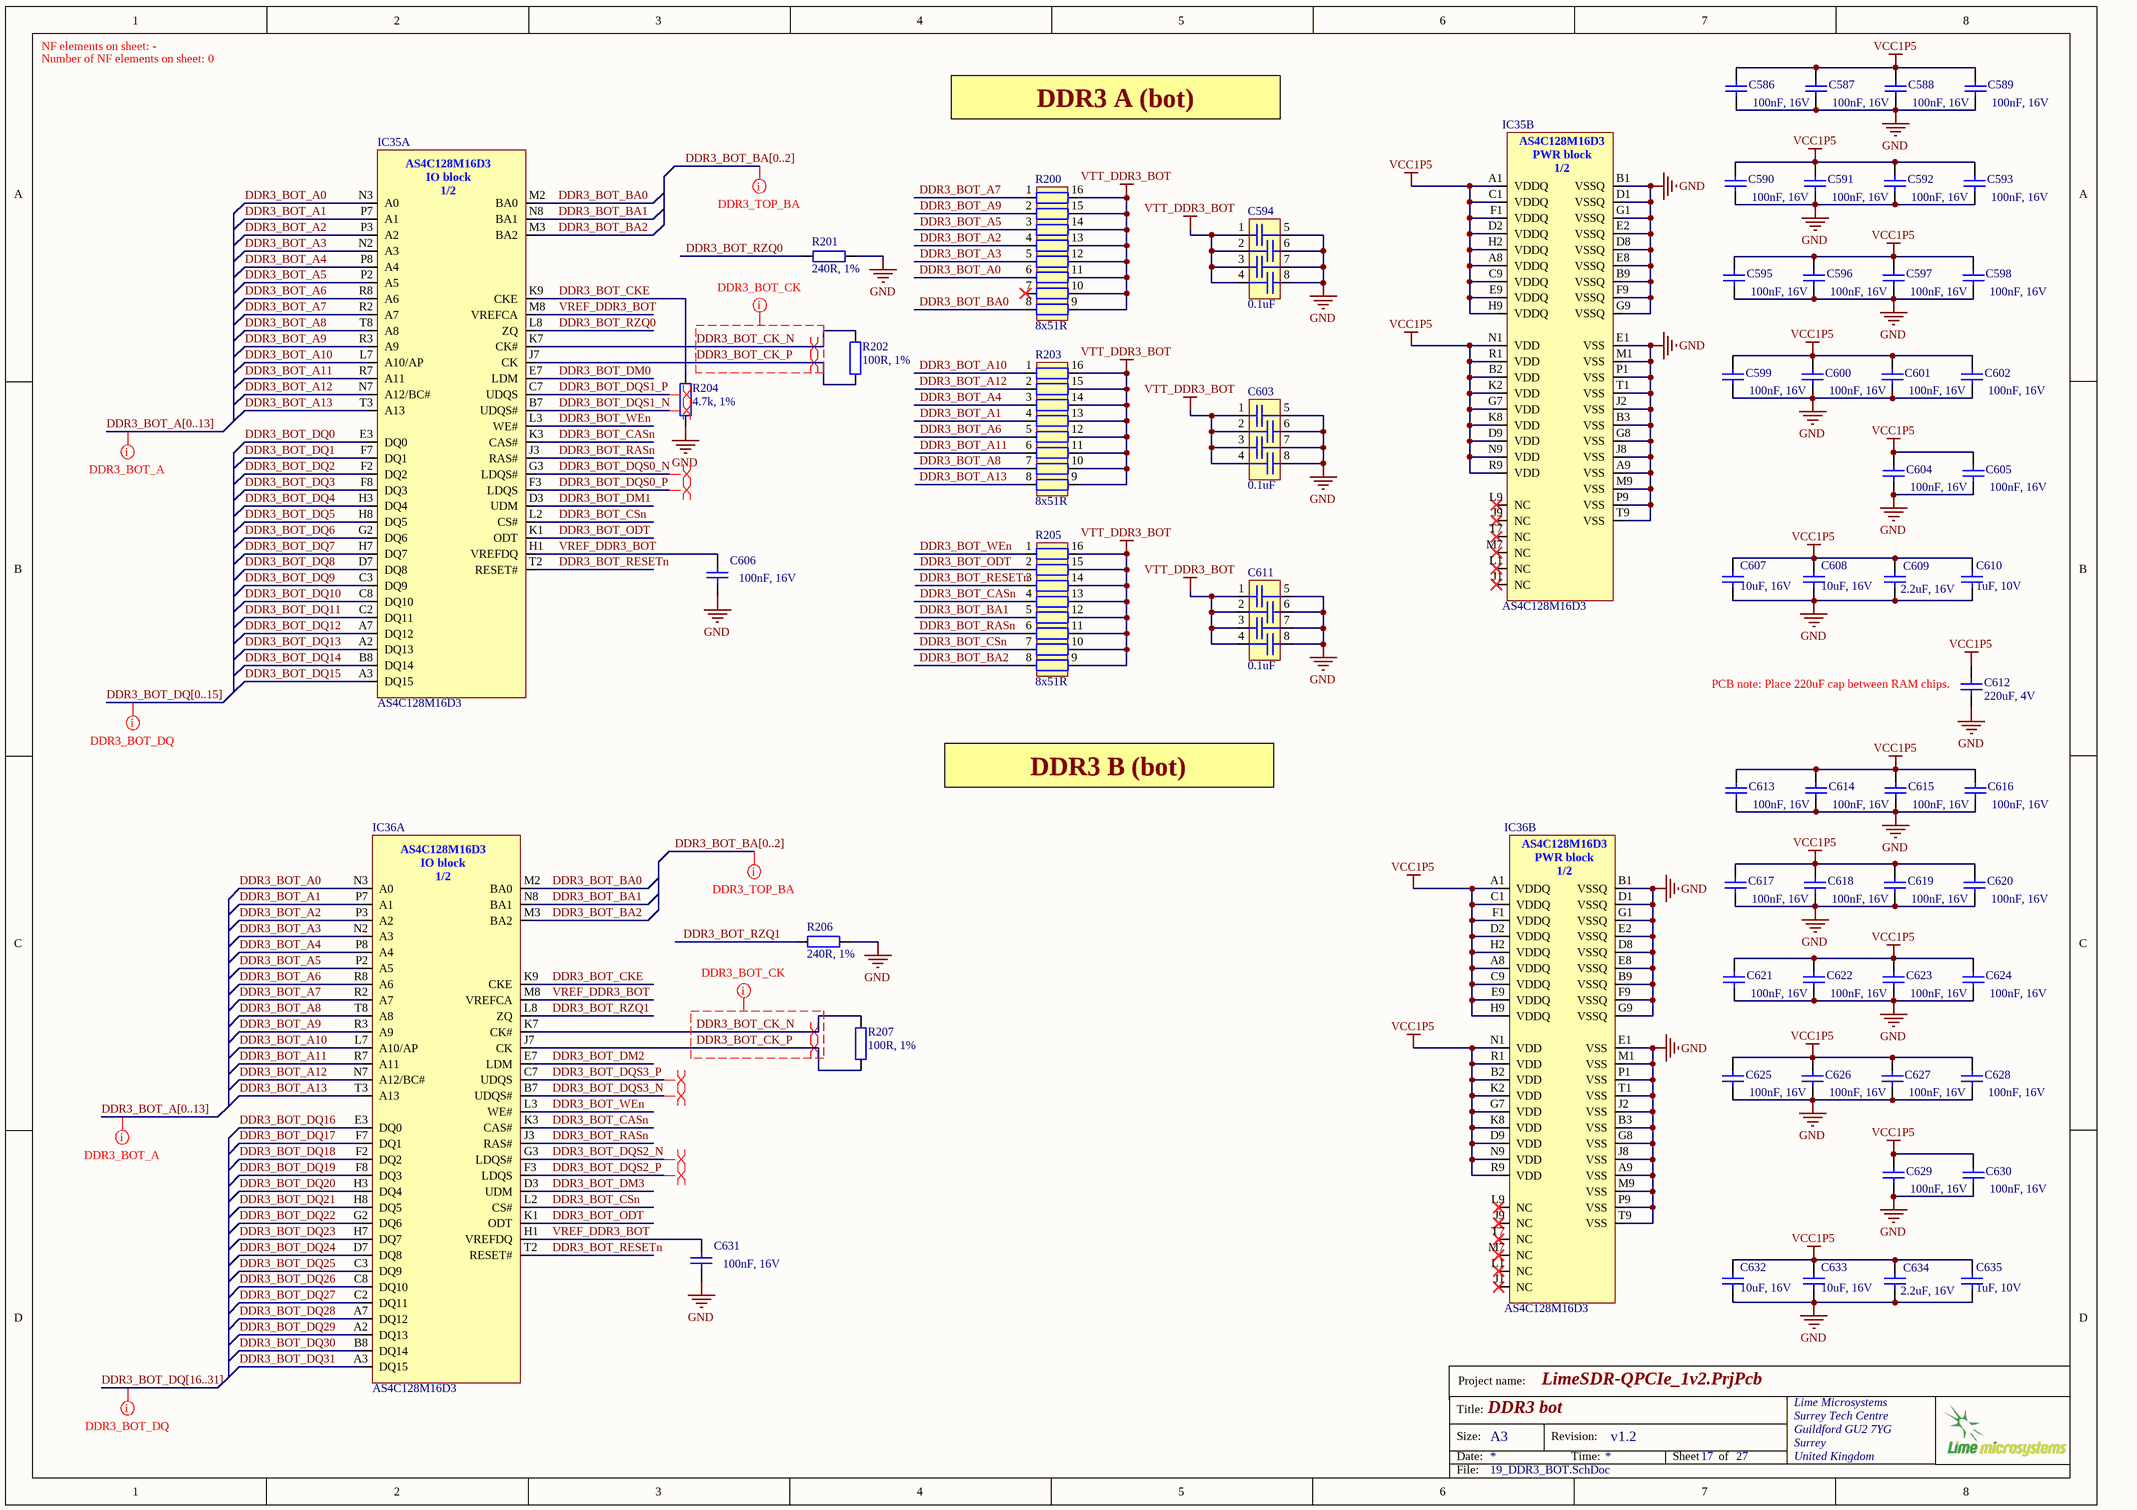
[diagram p18: 19_DDR3_BOT.SchDoc]

### Parts
C586  100nF, 16V  [CAP0402]
C587  100nF, 16V  [CAP0402]
C588  100nF, 16V  [CAP0402]
C589  100nF, 16V  [CAP0402]
C590  100nF, 16V  [CAP0402]
C591  100nF, 16V  [CAP0402]
C592  100nF, 16V  [CAP0402]
C593  100nF, 16V  [CAP0402]
C594  0.1uF  [CKCA43X7R1C104M100AA]
C595  100nF, 16V  [CAP0402]
C596  100nF, 16V  [CAP0402]
C597  100nF, 16V  [CAP0402]
C598  100nF, 16V  [CAP0402]
C599  100nF, 16V  [CAP0402]
C600  100nF, 16V  [CAP0402]
C601  100nF, 16V  [CAP0402]
C602  100nF, 16V  [CAP0402]
C603  0.1uF  [CKCA43X7R1C104M100AA]
C604  100nF, 16V  [CAP0402]
C605  100nF, 16V  [CAP0402]
C606  100nF, 16V  [CAP0402]
C607  10uF, 16V  [CAP0603]
C608  10uF, 16V  [CAP0603]
C609  2.2uF, 16V  [CAP0402]
C610  1uF, 10V  [CAP0402]
C611  0.1uF  [CKCA43X7R1C104M100AA]
C612  220uF, 4V  [CAP1206]
C613  100nF, 16V  [CAP0402]
C614  100nF, 16V  [CAP0402]
C615  100nF, 16V  [CAP0402]
C616  100nF, 16V  [CAP0402]
C617  100nF, 16V  [CAP0402]
C618  100nF, 16V  [CAP0402]
C619  100nF, 16V  [CAP0402]
C620  100nF, 16V  [CAP0402]
C621  100nF, 16V  [CAP0402]
C622  100nF, 16V  [CAP0402]
C623  100nF, 16V  [CAP0402]
C624  100nF, 16V  [CAP0402]
C625  100nF, 16V  [CAP0402]
C626  100nF, 16V  [CAP0402]
C627  100nF, 16V  [CAP0402]
C628  100nF, 16V  [CAP0402]
C629  100nF, 16V  [CAP0402]
C630  100nF, 16V  [CAP0402]
C631  100nF, 16V  [CAP0402]
C632  10uF, 16V  [CAP0603]
C633  10uF, 16V  [CAP0603]
C634  2.2uF, 16V  [CAP0402]
C635  1uF, 10V  [CAP0402]
IC35  AS4C128M16D3  [AS4C128M16D3]  (parts A,B of 2)
IC36  AS4C128M16D3  [AS4C128M16D3]  (parts A,B of 2)
R200  8x51R  [EXB2HV]
R201  240R, 1%  [RES0402]
R202  100R, 1%  [RES0402]
R203  8x51R  [EXB2HV]
R204  4.7k, 1%  [RES0402]
R205  8x51R  [EXB2HV]
R206  240R, 1%  [RES0402]
R207  100R, 1%  [RES0402]

### Nets
GND: C586.2 C587.2 C588.2 C589.2 C590.2 C591.2 C592.2 C593.2 C594.5 C594.6 C594.7 C594.8 C595.2 C596.2 C597.2 C598.2 C599.2 C600.2 C601.2 C602.2 C603.5 C603.6 C603.7 C603.8 C604.2 C605.2 C606.2 C607.1 C608.1 C609.2 C610.1 C611.5 C611.6 C611.7 C611.8 C612.1 C613.2 C614.2 C615.2 C616.2 C617.2 C618.2 C619.2 C620.2 C621.2 C622.2 C623.2 C624.2 C625.2 C626.2 C627.2 C628.2 C629.2 C630.2 C631.2 C632.1 C633.1 C634.2 C635.1 IC35.A9(VSS) IC35.B1(VSSQ) IC35.B3(VSS) IC35.B9(VSSQ) IC35.D1(VSSQ) IC35.D8(VSSQ) IC35.E1(VSS) IC35.E2(VSSQ) IC35.E8(VSSQ) IC35.F9(VSSQ) IC35.G1(VSSQ) IC35.G8(VSS) IC35.G9(VSSQ) IC35.J2(VSS) IC35.J8(VSS) IC35.M1(VSS) IC35.M9(VSS) IC35.P1(VSS) IC35.P9(VSS) IC35.T1(VSS) IC35.T9(VSS) IC36.A9(VSS) IC36.B1(VSSQ) IC36.B3(VSS) IC36.B9(VSSQ) IC36.D1(VSSQ) IC36.D8(VSSQ) IC36.E1(VSS) IC36.E2(VSSQ) IC36.E8(VSSQ) IC36.F9(VSSQ) IC36.G1(VSSQ) IC36.G8(VSS) IC36.G9(VSSQ) IC36.J2(VSS) IC36.J8(VSS) IC36.M1(VSS) IC36.M9(VSS) IC36.P1(VSS) IC36.P9(VSS) IC36.T1(VSS) IC36.T9(VSS) R201.2 R204.2 R206.2
VCC1P5: C586.1 C587.1 C588.1 C589.1 C590.1 C591.1 C592.1 C593.1 C595.1 C596.1 C597.1 C598.1 C599.1 C600.1 C601.1 C602.1 C604.1 C605.1 C607.2 C608.2 C609.1 C610.2 C612.2 C613.1 C614.1 C615.1 C616.1 C617.1 C618.1 C619.1 C620.1 C621.1 C622.1 C623.1 C624.1 C625.1 C626.1 C627.1 C628.1 C629.1 C630.1 C632.2 C633.2 C634.1 C635.2 IC35.A1(VDDQ) IC35.A8(VDDQ) IC35.B2(VDD) IC35.C1(VDDQ) IC35.C9(VDDQ) IC35.D2(VDDQ) IC35.D9(VDD) IC35.E9(VDDQ) IC35.F1(VDDQ) IC35.G7(VDD) IC35.H2(VDDQ) IC35.H9(VDDQ) IC35.K2(VDD) IC35.K8(VDD) IC35.N1(VDD) IC35.N9(VDD) IC35.R1(VDD) IC35.R9(VDD) IC36.A1(VDDQ) IC36.A8(VDDQ) IC36.B2(VDD) IC36.C1(VDDQ) IC36.C9(VDDQ) IC36.D2(VDDQ) IC36.D9(VDD) IC36.E9(VDDQ) IC36.F1(VDDQ) IC36.G7(VDD) IC36.H2(VDDQ) IC36.H9(VDDQ) IC36.K2(VDD) IC36.K8(VDD) IC36.N1(VDD) IC36.N9(VDD) IC36.R1(VDD) IC36.R9(VDD)
VREF_DDR3_BOT: C606.1 C631.1 IC35.H1(VREFDQ) IC35.M8(VREFCA) IC36.H1(VREFDQ) IC36.M8(VREFCA)
VTT_DDR3_BOT: C594.1 C594.2 C594.3 C594.4 C603.1 C603.2 C603.3 C603.4 C611.1 C611.2 C611.3 C611.4 R200.9 R200.10 R200.11 R200.12 R200.13 R200.14 R200.15 R200.16 R203.9 R203.10 R203.11 R203.12 R203.13 R203.14 R203.15 R203.16 R205.9 R205.10 R205.11 R205.12 R205.13 R205.14 R205.15 R205.16
DDR3_BOT_A0: IC35.N3(A0) IC36.N3(A0) R200.6
DDR3_BOT_A1: IC35.P7(A1) IC36.P7(A1) R203.4
DDR3_BOT_A2: IC35.P3(A2) IC36.P3(A2) R200.4
DDR3_BOT_A3: IC35.N2(A3) IC36.N2(A3) R200.5
DDR3_BOT_A4: IC35.P8(A4) IC36.P8(A4) R203.3
DDR3_BOT_A5: IC35.P2(A5) IC36.P2(A5) R200.3
DDR3_BOT_A6: IC35.R8(A6) IC36.R8(A6) R203.5
DDR3_BOT_A7: IC35.R2(A7) IC36.R2(A7) R200.1
DDR3_BOT_A8: IC35.T8(A8) IC36.T8(A8) R203.7
DDR3_BOT_A9: IC35.R3(A9) IC36.R3(A9) R200.2
DDR3_BOT_A10: IC35.L7(A10/AP) IC36.L7(A10/AP) R203.1
DDR3_BOT_A11: IC35.R7(A11) IC36.R7(A11) R203.6
DDR3_BOT_A12: IC35.N7(A12/BC#) IC36.N7(A12/BC#) R203.2
DDR3_BOT_A13: IC35.T3(A13) IC36.T3(A13) R203.8
DDR3_BOT_BA0: IC35.M2(BA0) IC36.M2(BA0) R200.8
DDR3_BOT_BA1: IC35.N8(BA1) IC36.N8(BA1) R205.5
DDR3_BOT_BA2: IC35.M3(BA2) IC36.M3(BA2) R205.8
DDR3_BOT_CASn: IC35.K3(CAS#) IC36.K3(CAS#) R205.4
DDR3_BOT_CK_N: IC35.K7(CK#) IC36.K7(CK#) R202.2 R207.2
DDR3_BOT_CK_P: IC35.J7(CK) IC36.J7(CK) R202.1 R207.1
DDR3_BOT_CKE: IC35.K9(CKE) IC36.K9(CKE) R204.1
DDR3_BOT_CSn: IC35.L2(CS#) IC36.L2(CS#) R205.7
DDR3_BOT_DM0: IC35.E7(LDM)
DDR3_BOT_DM1: IC35.D3(UDM)
DDR3_BOT_DM2: IC36.E7(LDM)
DDR3_BOT_DM3: IC36.D3(UDM)
DDR3_BOT_DQ0: IC35.E3(DQ0)
DDR3_BOT_DQ1: IC35.F7(DQ1)
DDR3_BOT_DQ2: IC35.F2(DQ2)
DDR3_BOT_DQ3: IC35.F8(DQ3)
DDR3_BOT_DQ4: IC35.H3(DQ4)
DDR3_BOT_DQ5: IC35.H8(DQ5)
DDR3_BOT_DQ6: IC35.G2(DQ6)
DDR3_BOT_DQ7: IC35.H7(DQ7)
DDR3_BOT_DQ8: IC35.D7(DQ8)
DDR3_BOT_DQ9: IC35.C3(DQ9)
DDR3_BOT_DQ10: IC35.C8(DQ10)
DDR3_BOT_DQ11: IC35.C2(DQ11)
DDR3_BOT_DQ12: IC35.A7(DQ12)
DDR3_BOT_DQ13: IC35.A2(DQ13)
DDR3_BOT_DQ14: IC35.B8(DQ14)
DDR3_BOT_DQ15: IC35.A3(DQ15)
DDR3_BOT_DQ16: IC36.E3(DQ0)
DDR3_BOT_DQ17: IC36.F7(DQ1)
DDR3_BOT_DQ18: IC36.F2(DQ2)
DDR3_BOT_DQ19: IC36.F8(DQ3)
DDR3_BOT_DQ20: IC36.H3(DQ4)
DDR3_BOT_DQ21: IC36.H8(DQ5)
DDR3_BOT_DQ22: IC36.G2(DQ6)
DDR3_BOT_DQ23: IC36.H7(DQ7)
DDR3_BOT_DQ24: IC36.D7(DQ8)
DDR3_BOT_DQ25: IC36.C3(DQ9)
DDR3_BOT_DQ26: IC36.C8(DQ10)
DDR3_BOT_DQ27: IC36.C2(DQ11)
DDR3_BOT_DQ28: IC36.A7(DQ12)
DDR3_BOT_DQ29: IC36.A2(DQ13)
DDR3_BOT_DQ30: IC36.B8(DQ14)
DDR3_BOT_DQ31: IC36.A3(DQ15)
DDR3_BOT_DQS0_N: IC35.G3(LDQS#)
DDR3_BOT_DQS0_P: IC35.F3(LDQS)
DDR3_BOT_DQS1_N: IC35.B7(UDQS#)
DDR3_BOT_DQS1_P: IC35.C7(UDQS)
DDR3_BOT_DQS2_N: IC36.G3(LDQS#)
DDR3_BOT_DQS2_P: IC36.F3(LDQS)
DDR3_BOT_DQS3_N: IC36.B7(UDQS#)
DDR3_BOT_DQS3_P: IC36.C7(UDQS)
DDR3_BOT_ODT: IC35.K1(ODT) IC36.K1(ODT) R205.2
DDR3_BOT_RASn: IC35.J3(RAS#) IC36.J3(RAS#) R205.6
DDR3_BOT_RESETn: IC35.T2(RESET#) IC36.T2(RESET#) R205.3
DDR3_BOT_RZQ0: IC35.L8(ZQ) R201.1
DDR3_BOT_RZQ1: IC36.L8(ZQ) R206.1
DDR3_BOT_WEn: IC35.L3(WE#) IC36.L3(WE#) R205.1

Not connected (* = marked no-connect by the designer): IC35 J1(NC)* J9(NC)* L1(NC)* L9(NC)* M7(NC)* T7(NC)*; IC36 J1(NC)* J9(NC)* L1(NC)* L9(NC)* M7(NC)* T7(NC)*; R200 7*

### Buses and harness runs
bus DDR3_BOT_A[0..13]
bus DDR3_BOT_BA[0..2]
bus DDR3_BOT_DQ[0..15]
bus DDR3_BOT_DQ[16..31]

### Layout directives
net class DDR3_BOT_DQ: (no net found under the mark)
net class DDR3_TOP_BA: (no net found under the mark)
net class DDR3_BOT_A: (no net found under the mark)
differential pair: DDR3_BOT_CK_N, DDR3_BOT_CK_P, DDR3_BOT_DQS0_N, DDR3_BOT_DQS0_P, DDR3_BOT_DQS1_N, DDR3_BOT_DQS1_P, DDR3_BOT_DQS2_N, DDR3_BOT_DQS2_P, DDR3_BOT_DQS3_N, DDR3_BOT_DQS3_P
net class DDR3_BOT_CK: (no net found under the mark), DDR3_BOT_CK_N, DDR3_BOT_CK_P

### Notes on the sheet
- NF elements on sheet: -
- Number of NF elements on sheet: 0
- DDR3 A (bot)
- (near C612) PCB note: Place 220uF cap between RAM chips.
- DDR3 B (bot)
- Project name:
- Title:
- Size:
- Date:
- A3
- Revision:
- Time:
- Sheet
- of
- File:
- (in symbol AS4C128M16D3, part A) AS4C128M16D3 / IO block / 1/2
- (in symbol AS4C128M16D3, part B) AS4C128M16D3 / PWR block / 1/2

### Library data of the parts
C586-C593 C595-C602 C604-C606 C613-C631 = Cap_0603: as C536 on sheet 18_DDR3_TOP; Supplier 1: Mouser; Supplier Part Number 1: 81-GRM155R71C104KA88; Case Code - in: 0402; Manufacturer: Murata Electronics; Category: Multilayer Ceramic Capacitors MLCC - SMD/SMT; Voltage Rating DC: 16 V; Value: 100nF, 16V; Case Code - mm: 1005; Case Width: 0.5 mm; Manufacturer Part Number: GRM155R71C104KA88D; Maximum Operating Temperature: + 125 C; Minimum Operating Temperature: - 55 C; Minimum Order Quantity: 1; Operating Temperature Range: - 55 C to + 125 C; Package / Case: 0402 (1005 metric); Packaging: Reel; Product: General Type MLCCs; Product Category: Low & Medium Capacitance SMD Ceramic Chip Capacitors; Reeling: True; RoHS - Mouser: Y; RoHS: RoHS Compliant; Series: GRM; Standard Pack Qty: 10000; Termination Style: SMD/SMT
C594 C603 C611 = 4X_cap_array_1206: as C544 on sheet 18_DDR3_TOP; Value: 0.1uF; Supplier 1: Mouser; Supplier Part Number 1: 810-CKCA43X7R1C104M; RoHS: RoHS Compliant; Termination Style: SMD/SMT; Brand: TDK; Category: Capacitor Arrays & Networks; Product: Ceramic Capacitor Arrays; Series: CKC; Packaging: Reel; Operating Temperature Range: - 55 C to + 125 C; Manufacturer Part Number 1: CKCA43X7R1C104M100AA; Capacitance: 0.1 uF; Product Category: Capacitor Arrays; Standard Pack Qty: 2000; RoHS - Mouser: Y; Minimum Order Quantity: 1; Reeling: True
C607 C608 C632 C633 = Cap_0603: as C557 on sheet 18_DDR3_TOP; Supplier 1: Digi-Key; Supplier Part Number 1: 490-7201-2-ND; Package / Case: 0603 (1608 Metric); Category: Capacitors; Voltage - Rated: 16V; Value: 10uF, 16V; Applications: General Purpose; Features: -; Height - Seated (Max): -; Lead Spacing: -; Lead Style: -; Mounting Type: Surface Mount, MLCC; Operating Temperature: -55°C ~ 85°C; Packaging: Tape & Reel (TR); Ratings: -; RoHS: RoHS Compliant; Size / Dimension: 0.063" L x 0.031" W (1.60mm x 0.80mm); Thickness (Max): 0.039" (1.00mm)
C609 C634 = Cap_0603: as C559 on sheet 18_DDR3_TOP; Value: 2.2uF, 16V; Supplier 1: Digi-Key; Supplier Part Number 1: 445-9085-6-ND; Tolerance: ±10%; Operating Temperature: -55°C ~ 85°C; Voltage - Rated: 16V; Category: Capacitors; Package / Case: 0402 (1005 Metric); Operating Temperature Range: -55°C to +85; Applications: General Purpose; Features: -; Height - Seated (Max): -; Lead Spacing: -; Lead Style: -; Mounting Type: Surface Mount, MLCC; Packaging: Tape & Reel (TR); Ratings: -; RoHS: RoHS Compliant; Size / Dimension: 0.039" L x 0.020" W (1.00mm x 0.50mm); Temperature Coefficient: X5R; Thickness (Max): 0.022" (0.55mm)
C610 C635 = Cap_0603: as C560 on sheet 18_DDR3_TOP; Supplier 1: Newark; Supplier Part Number 1: 490-6298-2-ND; Value: 1uF, 10V; MSL: -; RoHS: YES
C612 = Cap_1206: as C335 on sheet 16_FPGA_pwr_banks; Package / Case: 1206 (3216 Metric); Supplier 1: Digi-Key; Packaging: Cut Tape (CT); Size / Dimension: 0.126" L x 0.063" W (3.20mm x 1.60mm); Operating Temperature: -55°C ~ 85°C; Voltage - Rated: 4V; Mounting Type: Surface Mount, MLCC; Ratings: -; Supplier Part Number 1: 490-9774-1-ND; Category: Capacitors; Lead Spacing: -; Lead Style: -; Applications: General Purpose; Features: -; Height - Seated (Max): -; Thickness (Max): 0.075" (1.90mm); RoHS: RoHS Compliant; Value: 220uF, 4V; Manufacturer Part Number 1: GRM31CR60G227ME11L
IC35 IC36 = AS4C128M16D3: as IC33 on sheet 18_DDR3_TOP; Supplier 1: Digi-Key; Supplier Part Number 1: 1450-1083-ND; Supplier Device Package: 96-FBGA (13x9); Package / Case: 96-TFBGA; Supplier: Digi-Key; Category: Integrated Circuits (ICs)
R200 R203 R205 = 8X_resistor_array_0402: as R192 on sheet 18_DDR3_TOP; Supplier 1: Farnell; Supplier Part Number 1: 2060069RL; Manufacturer: Panasonic Electronic Components
R201 R206 = Res_0402: as R193 on sheet 18_DDR3_TOP; Supplier 1: Digi-Key; Supplier Part Number 1: 541-240LDKR-ND; Tolerance: ±1%; Supplier Device Package: 0402 (1005 Metric); Category: Resistors; Value: 240R, 1%
R202 R207 = Res_0402: as R194 on sheet 18_DDR3_TOP; Supplier 1: Digi-Key; Supplier Part Number 1: RMCF0402FT100RDKR-ND; Package / Case: 0402 (1005 Metric); Composition: Thick Film; Category: Resistors; Tolerance: ±1%; Value: 100R, 1%
R204 = Res_0402: as R196 on sheet 18_DDR3_TOP; Number of Terminations: 2; Category: Resistors; Supplier 1: Digi-Key; Height: 0.016" (0.40mm); Features: Moisture Resistant; Size / Dimension: 0.039" L x 0.020" W (1.00mm x 0.50mm); Supplier Device Package: 0402; RoHS: RoHS Compliant; Composition: Thick Film; Package / Case: 0402 (1005 Metric); Resistance (Ohms): 4.7k; Operating Temperature: -55°C ~ 155°C; Tolerance: ±1%; Supplier Part Number 1: 311-4.7KLRCT-ND; Packaging: Cut Tape (CT); Value: 4.7k, 1%